# Altium project RK_MEGAPLATA.PrjPcb (part 1 of 9)
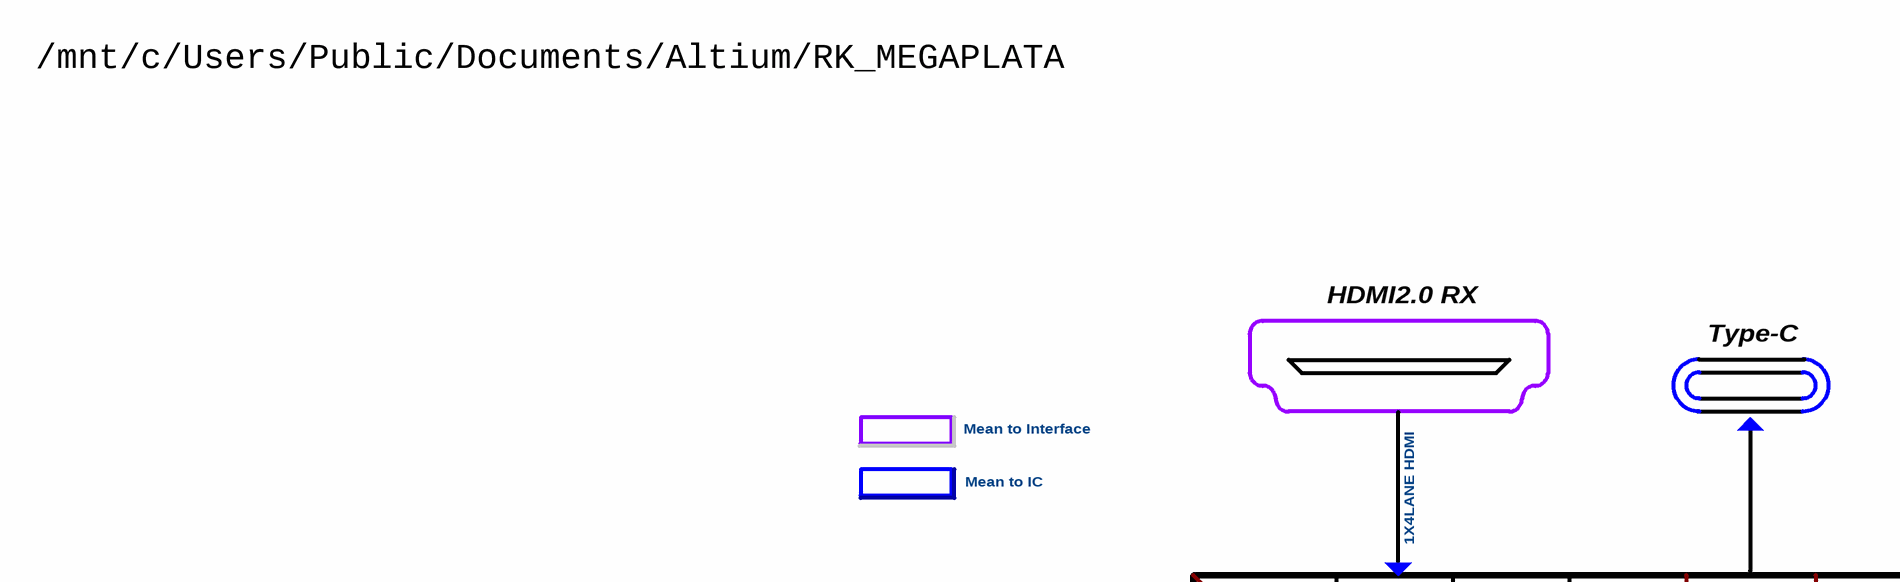
[diagram p0: BLOCK_DIAGRAM.SchDoc, top left]
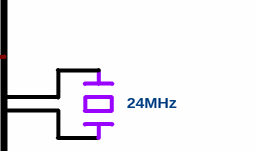
[diagram p1: BLOCK_DIAGRAM.SchDoc, top right]
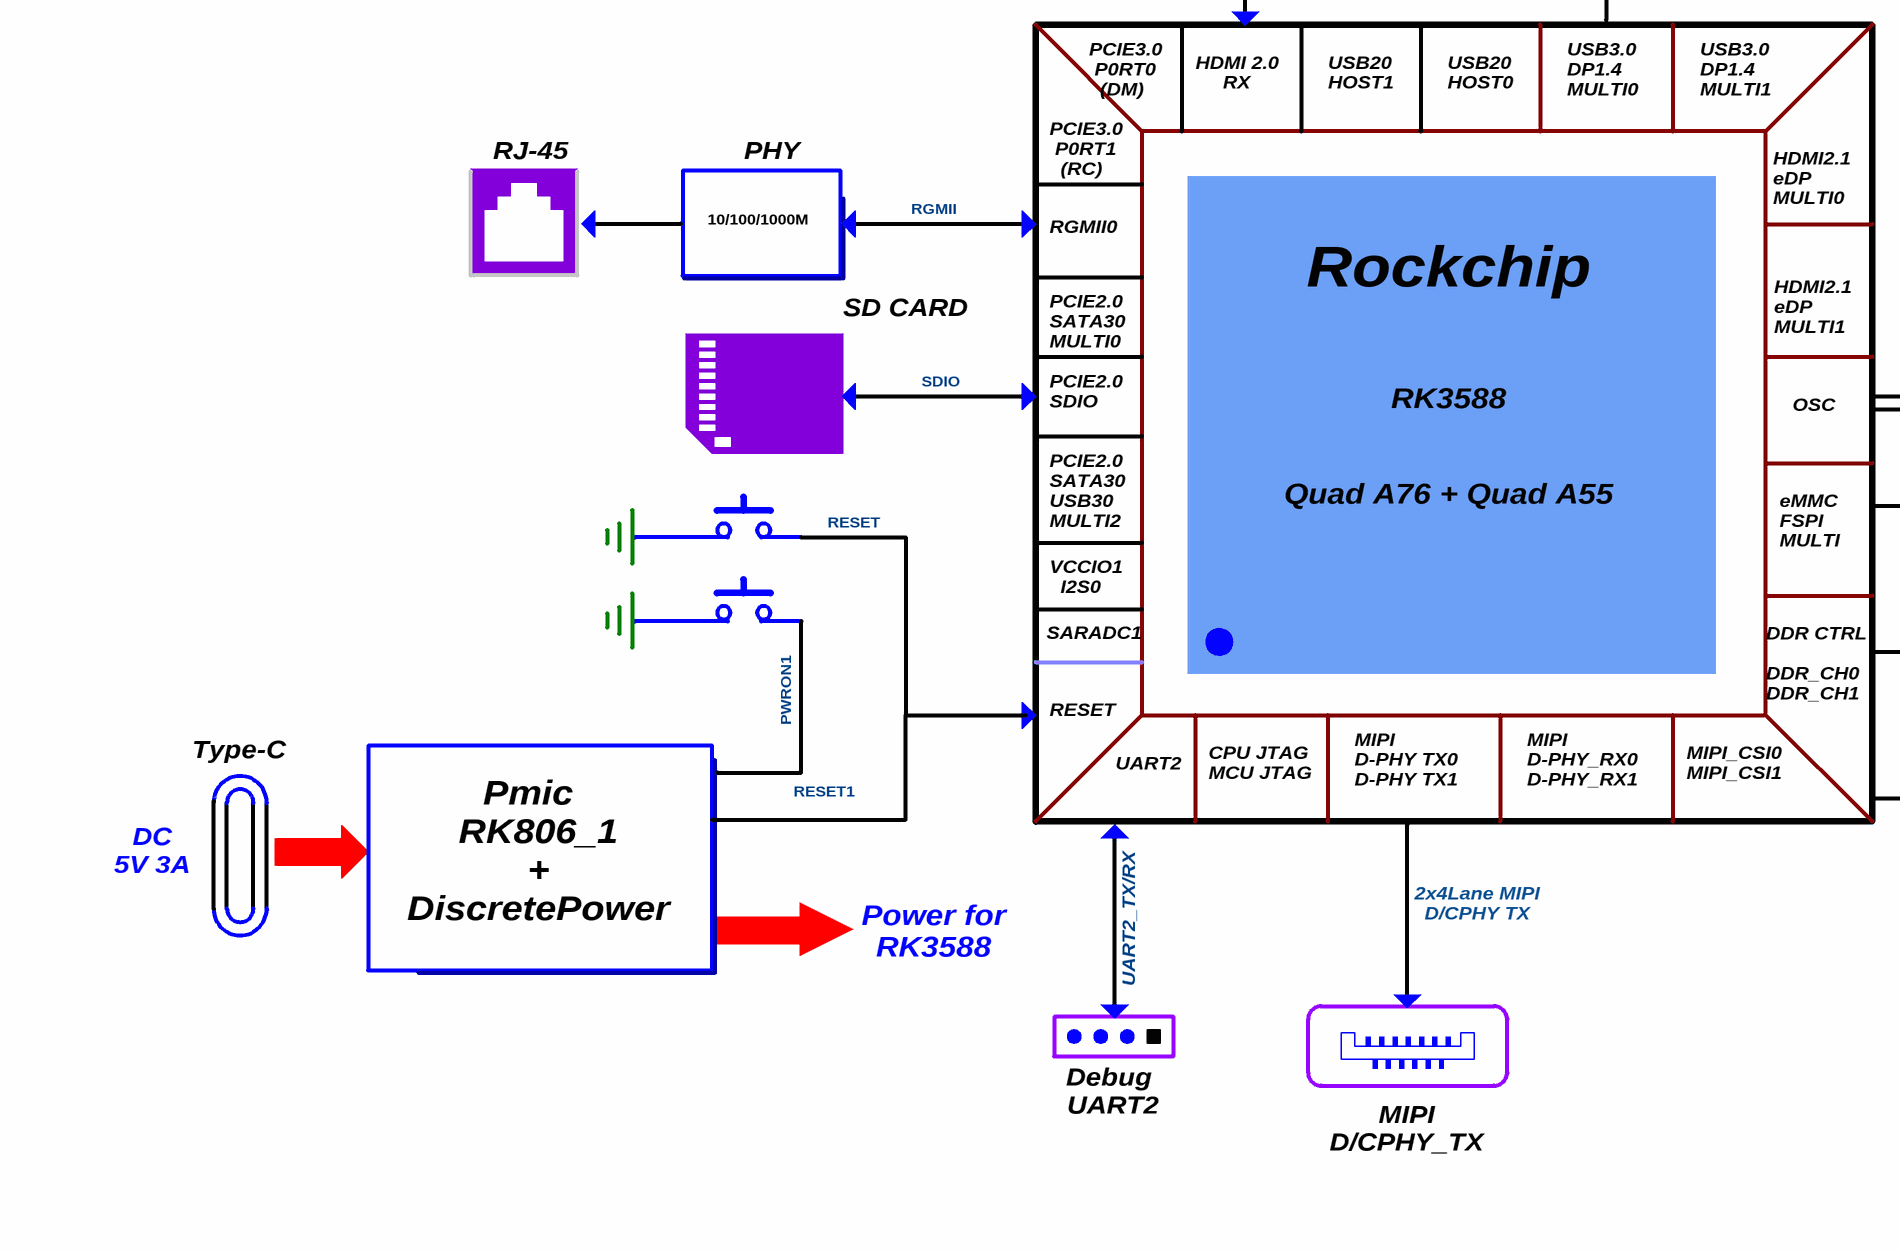
[diagram p2: BLOCK_DIAGRAM.SchDoc, bottom left]
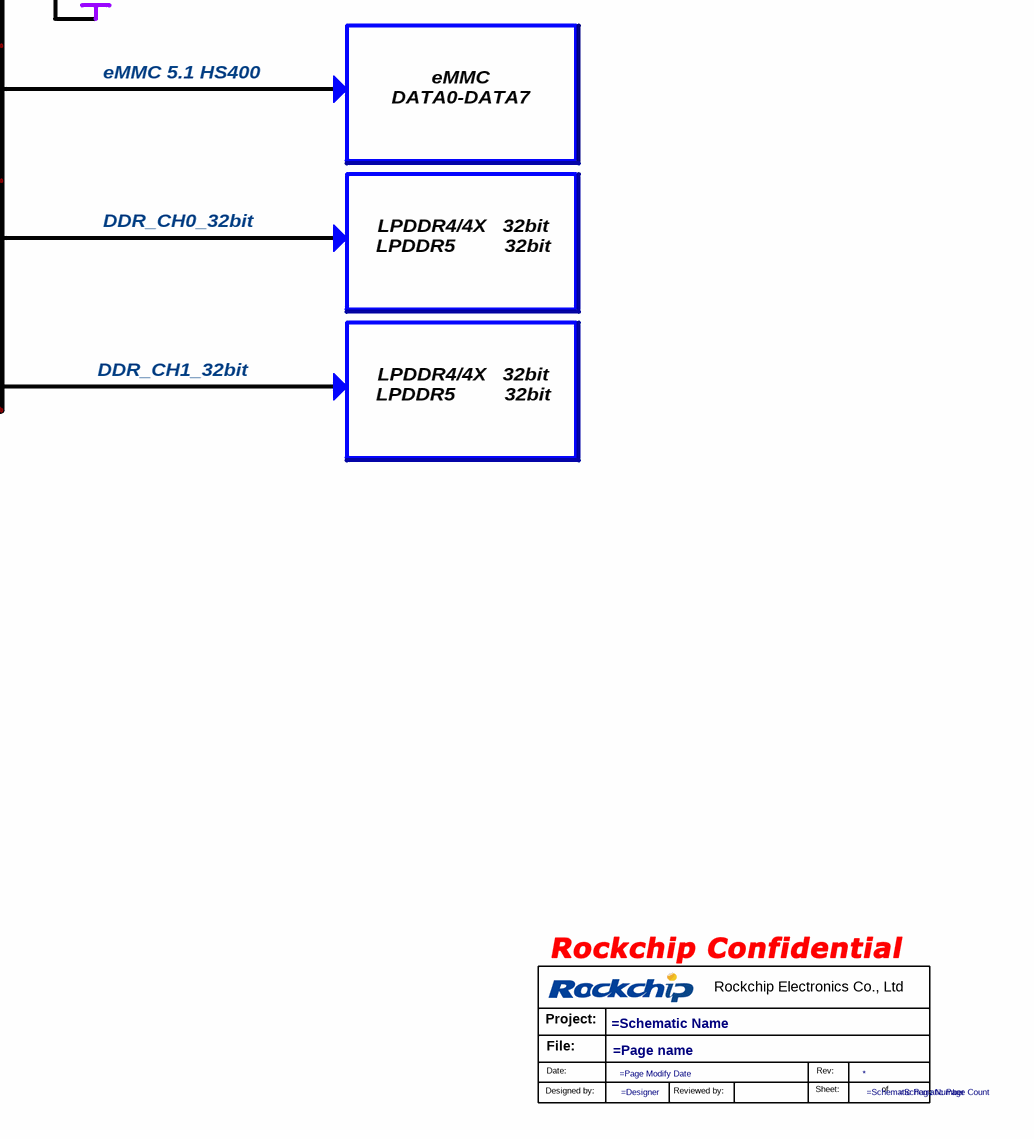
[diagram p3: BLOCK_DIAGRAM.SchDoc, bottom right]
22 sheets, 681 parts. Net scope: flat (ports and power ports of the same name join across sheets).
Sheets:
  BLOCK_DIAGRAM.SchDoc
  RK3588_OSC_PLL.SchDoc
  RK3588_DDR.SchDoc
  RK3588_FLASH_SD_EMMC.SchDoc
  RK3588_TYPE_C.SchDoc
  RK3588_BOOTLOADER_MAYBE_SDIO.SchDoc
  RK3588_MIPI.SchDoc
  RK3588_PCIE20_30.SchDoc
  RK3588_HDMI.SchDoc
  RK3588_GPIO_MAYBE_IMPORTANT_PINS.SchDoc
  UART_DEBUG.SchDoc
  POWER_IN_TYPE_C.SchDoc
  POWER_RK806.SchDoc
  PORT_TYPE_C.SchDoc
  DRAM_LPDDR4X_200P_2X32bit.SchDoc
  FLASH_EMMC.SchDoc
  FLASH_SD_CARD.SchDoc
  SD_CARD_SDIO.SchDoc
  HDMI2_0_RX.SchDoc
  MIPI_D_CPHY_TX_DUAL.SchDoc
  ETHERNET_PHY_RGMII.SchDoc
  BUTTON.SchDoc

## Sheet BLOCK_DIAGRAM.SchDoc
size 594 x 420 mm; SheetNumber: 1; SheetTotal: 25

### Parts
*?  (no value)  (graphical)

### Notes on the sheet
- /mnt/c/Users/Public/Documents/Altium/RK_MEGAPLATA
- HDMI2.0 RX
- Type-C
- Mean to Interface
- Mean to IC
- 1X4LANE HDMI
- HDMI 2.0
  RX
- USB20
  HOST1
- USB20
  HOST0
- USB3.0
  DP1.4
  MULTI0
- USB3.0
  DP1.4
  MULTI1
- RJ-45
- PHY
- PCIE3.0
  P0RT0
  (DM)
- 10/100/1000M
- RGMII
- PCIE3.0
  P0RT1
  (RC)
- HDMI2.1
  eDP
  MULTI0
- RGMII0
- SD CARD
- PCIE2.0
  SATA30
  MULTI0
- Rockchip
- HDMI2.1
  eDP
  MULTI1
- SDIO
- PCIE2.0
  SDIO
- OSC
- 24MHz
- eMMC 5.1 HS400
- RESET
- PCIE2.0
  SATA30
  USB30
  MULTI2
- RK3588
  Quad A76 + Quad A55
- eMMC
  FSPI
  MULTI
- eMMC
  DATA0-DATA7
- VCCIO1
  I2S0
- SARADC1
- DDR_CH0_32bit
- LPDDR4/4X   32bit
  LPDDR5         32bit
- PWRON1
- DDR CTRL
  DDR_CH0
  DDR_CH1
- RESET1
- UART2
- CPU JTAG
  MCU JTAG
- MIPI
  D-PHY TX0
  D-PHY TX1
- MIPI
  D-PHY_RX0
  D-PHY_RX1
- MIPI_CSI0
  MIPI_CSI1
- DDR_CH1_32bit
- DC
  5V 3A
- Pmic
  RK806_1
  +
  DiscretePower
- Power for RK3588
- 2x4Lane MIPI D/CPHY TX
- UART2_TX/RX
- Debug
  UART2
- MIPI
  D/CPHY_TX
- 420x594
- Формат А2
- (in symbol Rockchip_new) Rockchip Electronics Co., Ltd; Project:; File:; Date:; Rev:; Designed by:; Reviewed by:; Sheet:; of

### Library data of the parts
*? = Rockchip_new: Schematic Page Count: =Schematic Page Count; Schematic Page Number: =Schematic Page Number; Designer: =Designer; Page Modify Date: =Page Modify Date; Title: *; Revcode: =Revcode; Page name: =Page name; Schematic Name: =Schematic Name; Revision: *; Check: =Check; Page Count: =Page Count; Page Number: =Page Number; OrgAddr4: =OrgAddr4; OrgAddr3: =OrgAddr3; OrgAddr2: =OrgAddr2; OrgAddr1: =OrgAddr1; OrgName: =OrgName; Cage Code: =Cage Code; Doc: =Doc

## Sheet RK3588_OSC_PLL.SchDoc
size 594 x 420 mm; SheetNumber: 3; SheetTotal: 23
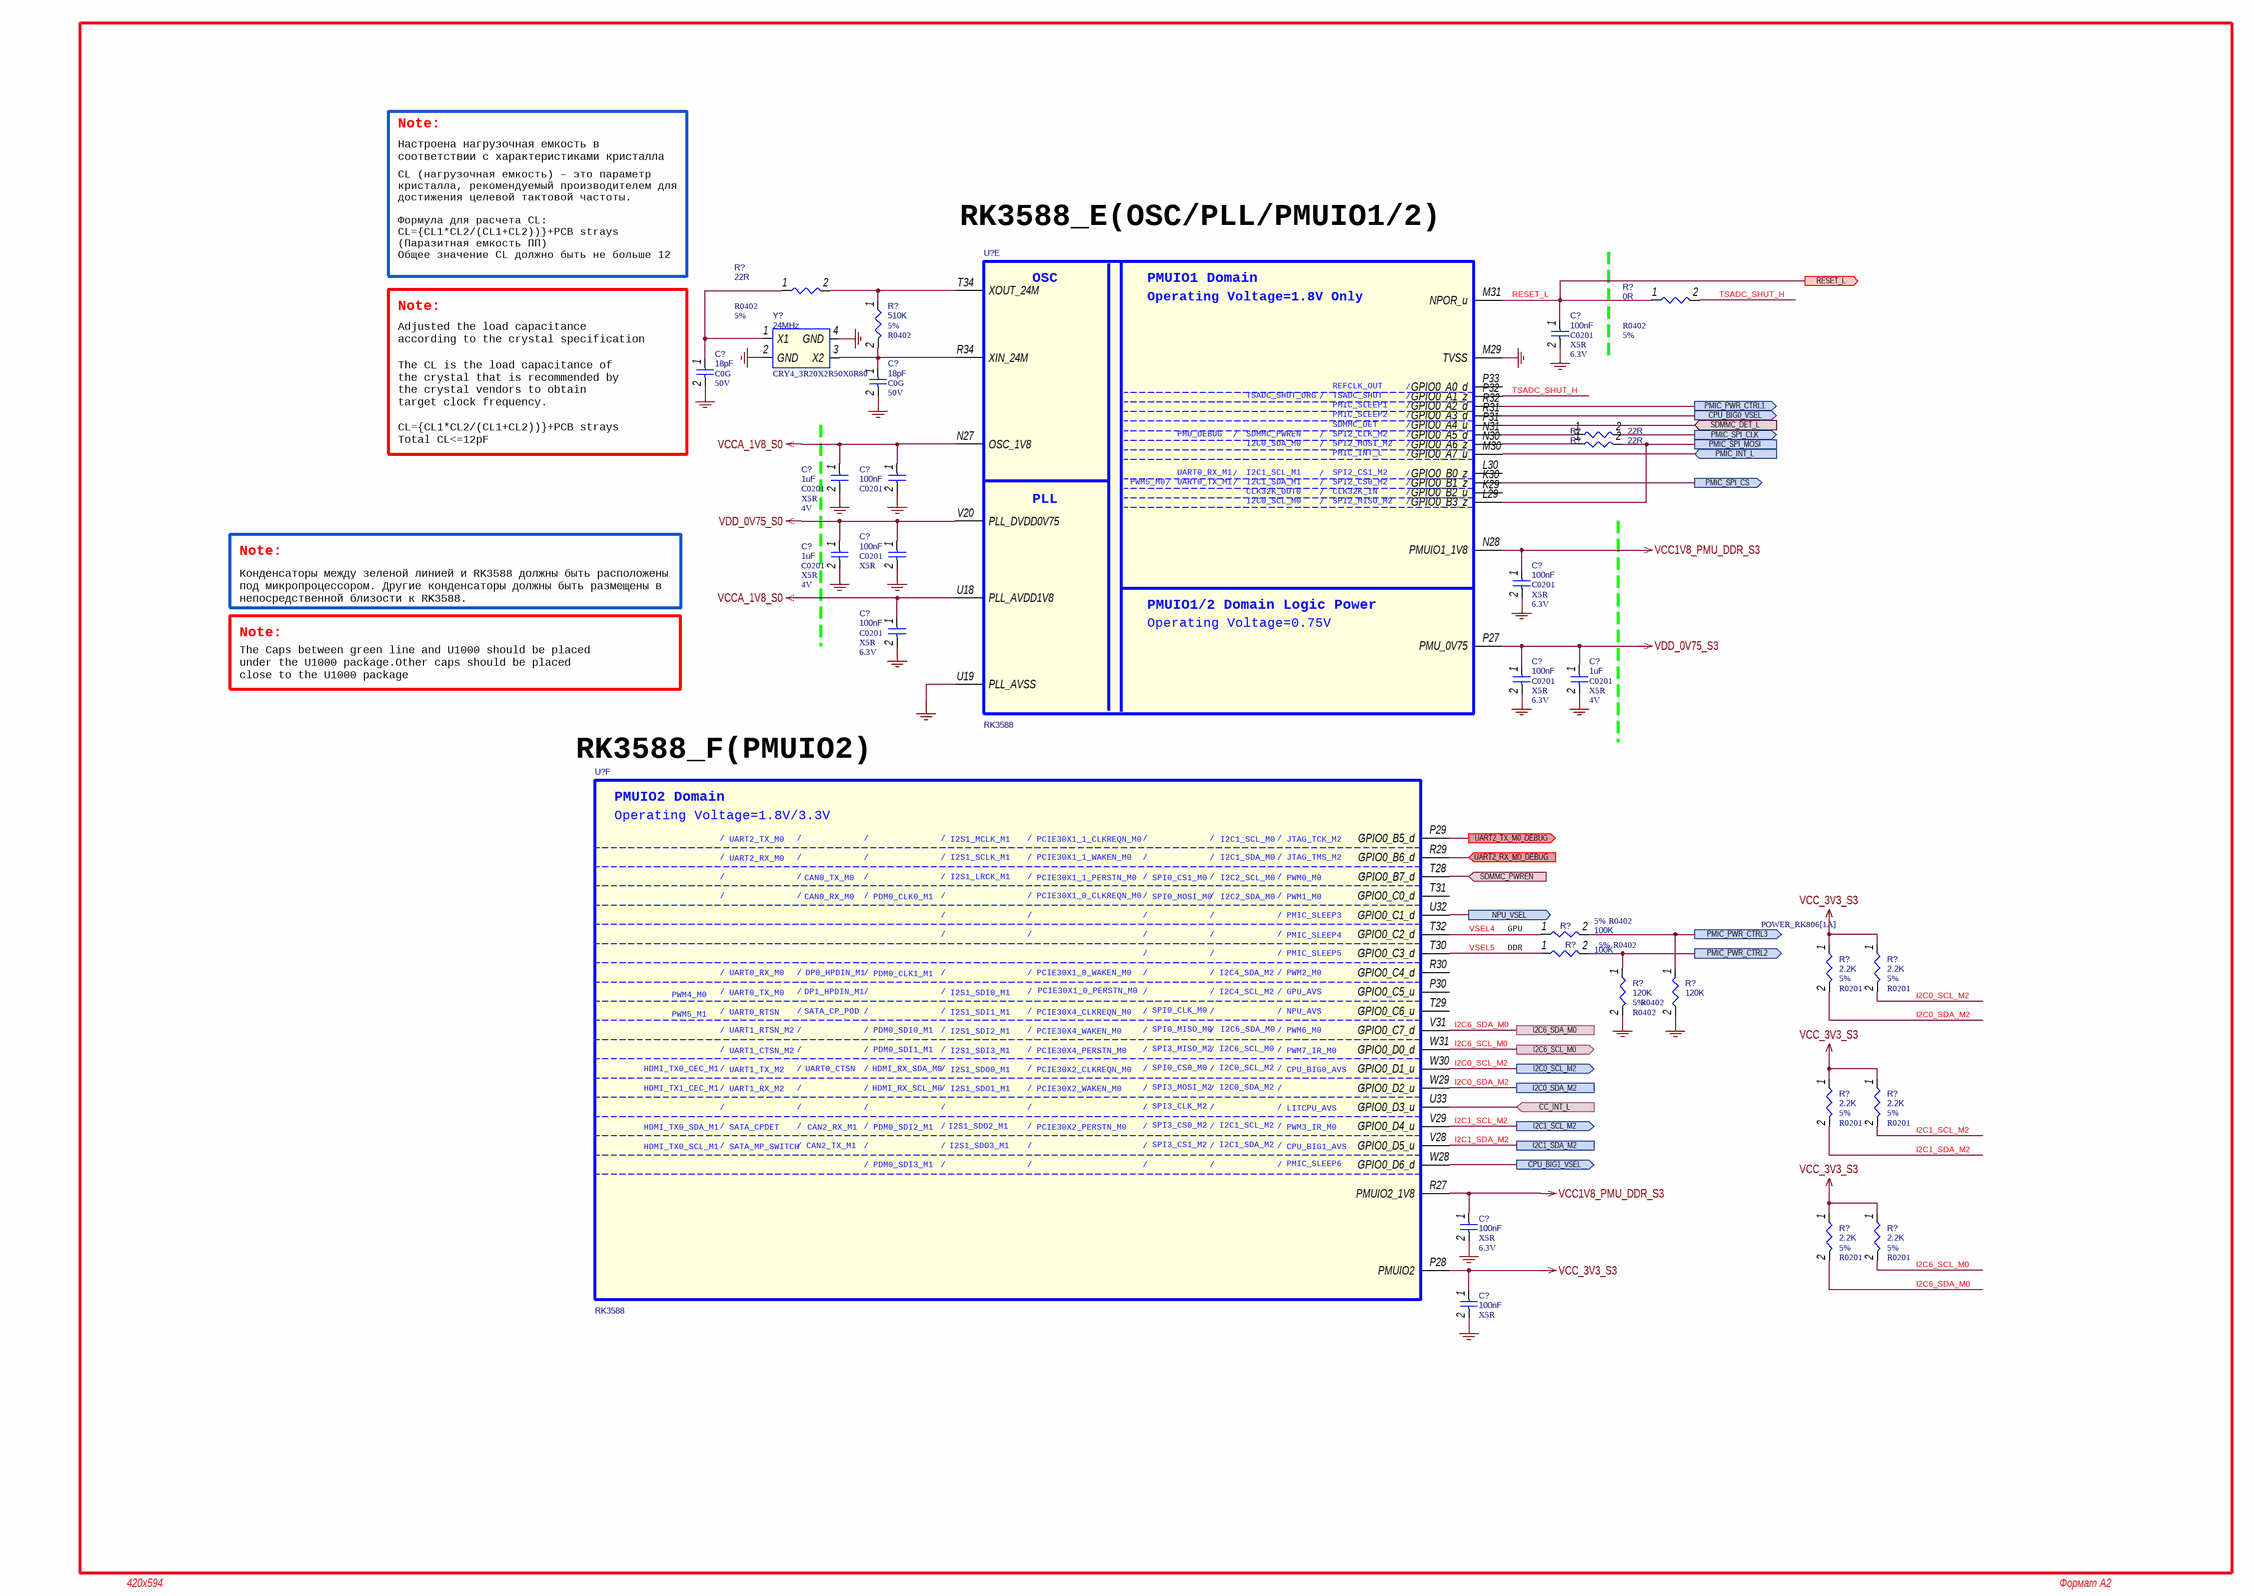
[diagram p4: RK3588_OSC_PLL.SchDoc]

### Parts
(Parts that share a designator on the sheet are numbered #1, #2 ... from top to bottom, then left to right.)
C?#1  100nF  Dielectric: X5R  Voltage: 6.3V  [C0201]
C?#2  18pF  Dielectric: C0G  Voltage: 50V  [C0402]
C?#3  18pF  Dielectric: C0G  Voltage: 50V  [C0402]
C?#4  1uF  Dielectric: X5R  Voltage: 4V  [C0201]
C?#5  100nF  [C0201]
C?#6  1uF  Dielectric: X5R  Voltage: 4V  [C0201]
C?#7  100nF  Dielectric: X5R  [C0201]
C?#8  100nF  Dielectric: X5R  Voltage: 6.3V  [C0201]
C?#9  100nF  Dielectric: X5R  Voltage: 6.3V  [C0201]
C?#10  100nF  Dielectric: X5R  Voltage: 6.3V  [C0201]
C?#11  1uF  Dielectric: X5R  Voltage: 4V  [C0201]
C?#12  100nF  Dielectric: X5R  Voltage: 6.3V  [C0201]
C?#13  100nF  Dielectric: X5R  [C0201]
R?#1  22R  Tolerance: 5%  [R0402]
R?#2  510K  Tolerance: 5%  [R0402]
R?#3  0R  Tolerance: 5%  [R0402]
R?#4  22R  [R0402]
R?#5  22R  [R0402]
R?#6  100K  Tolerance: 5%  [R0402]
R?#7  2.2K  Tolerance: 5%  PCB Footprint: R0201  [R0402]
R?#8  2.2K  Tolerance: 5%  PCB Footprint: R0201  [R0402]
R?#9  100K  Tolerance: 5%  [R0402]
R?#10  120K  Tolerance: 5%  [R0402]
R?#11  120K  [R0402]
R?#12  2.2K  Tolerance: 5%  PCB Footprint: R0201  [R0402]
R?#13  2.2K  Tolerance: 5%  PCB Footprint: R0201  [R0402]
R?#14  2.2K  Tolerance: 5%  PCB Footprint: R0201  [R0402]
R?#15  2.2K  Tolerance: 5%  PCB Footprint: R0201  [R0402]
U?#1  RK3588  [BGA1088_23R00X23R00X2R00]  (part E of 26)
U?#2  RK3588  [BGA1088_23R00X23R00X2R00]  (part F of 26)
Y?#1  24MHz  PCB Footprint: CRY4_3R20X2R50X0R80  [CRY-3225]

### Ports
CC_INT_L (in, see PORT_TYPE_C[2D]), CPU_BIG0_VSEL (out, see POWER_RK806[1A]), CPU_BIG1_VSEL (out, see POWER_RK806[1A]), I2C0_SCL_M2 (out, see POWER_RK806[1A]), I2C0_SDA_M2 (see POWER_RK806[1A]), I2C1_SCL_M2 (out, see POWER_RK806[1A]), I2C1_SDA_M2 (see POWER_RK806[1A]), I2C6_SCL_M0 (out, see PORT_TYPE_C[2D]), I2C6_SDA_M0 (see PORT_TYPE_C[2D]), NPU_VSEL (out, see POWER_RK806[1A]), PMIC_INT_L (in, see POWER_RK806[1A]), PMIC_PWR_CTRL1 (out, see POWER_RK806[1A]), PMIC_PWR_CTRL2 (out, see POWER_RK806[1A]), PMIC_PWR_CTRL3 (out, see POWER_RK806[1A]), PMIC_SPI_CLK (out, see POWER_RK806[1A]), PMIC_SPI_CS (out, see POWER_RK806[1A]), PMIC_SPI_MOSI (see POWER_RK806[1A]), RESET_L (out, see BUTTON[2B], POWER_RK806[1A]), SDMMC_DET_L (in, see FLASH_SD_CARD[2C]), SDMMC_PWREN (in, see FLASH_SD_CARD[2A]), UART2_RX_M0_DEBUG (in, see UART_DEBUG[2B]), UART2_TX_M0_DEBUG (out, see UART_DEBUG[2B])

### Nets
GND: C?#1.2 C?#2.2 C?#3.2 C?#4.2 C?#5.2 C?#6.2 C?#7.2 C?#8.2 C?#9.2 C?#10.2 C?#11.2 C?#12.2 C?#13.2 R?#10.2 R?#11.2 U?#1.M29(TVSS) U?#1.U19(PLL_AVSS) Y?#1.2(GND) Y?#1.4(GND)
VCC1V8_PMU_DDR_S3: C?#8.1 C?#12.1 U?#1.N28(PMUIO1_1V8) U?#2.R27(PMUIO2_1V8)
VCC_3V3_S3: C?#13.1 R?#7.1 R?#8.1 R?#12.1 R?#13.1 R?#14.1 R?#15.1 U?#2.P28(PMUIO2)
VCCA_1V8_S0: C?#4.1 C?#5.1 C?#9.1 U?#1.N27(OSC_1V8) U?#1.U18(PLL_AVDD1V8)
VDD_0V75_S0: C?#6.1 C?#7.1 U?#1.V20(PLL_DVDD0V75)
VDD_0V75_S3: C?#10.1 C?#11.1 U?#1.P27(PMU_0V75)
CC_INT_L: U?#2.U33(GPIO0_D3_u) ; port CC_INT_L
CPU_BIG0_VSEL: U?#1.R31(GPIO0_A3_d) ; port CPU_BIG0_VSEL
CPU_BIG1_VSEL: U?#2.W28(GPIO0_D6_d) ; port CPU_BIG1_VSEL
I2C0_SCL_M2: R?#8.2 U?#2.W30(GPIO0_D1_u) ; port I2C0_SCL_M2
I2C0_SDA_M2: R?#7.2 U?#2.W29(GPIO0_D2_u) ; port I2C0_SDA_M2
I2C1_SCL_M2: R?#13.2 U?#2.V29(GPIO0_D4_u) ; port I2C1_SCL_M2
I2C1_SDA_M2: R?#12.2 U?#2.V28(GPIO0_D5_u) ; port I2C1_SDA_M2
I2C6_SCL_M0: R?#15.2 U?#2.W31(GPIO0_D0_d) ; port I2C6_SCL_M0
I2C6_SDA_M0: R?#14.2 U?#2.V31(GPIO0_C7_d) ; port I2C6_SDA_M0
NPU_VSEL: U?#2.U32(GPIO0_C1_d) ; port NPU_VSEL
PMIC_INT_L: U?#1.M30(GPIO0_A7_u) ; port PMIC_INT_L
PMIC_PWR_CTRL1: U?#1.R32(GPIO0_A2_d) ; port PMIC_PWR_CTRL1
PMIC_PWR_CTRL2: R?#9.2 R?#10.1 ; port PMIC_PWR_CTRL2
PMIC_PWR_CTRL3: R?#6.2 R?#11.1 ; port PMIC_PWR_CTRL3
PMIC_SPI_CLK: R?#4.2 ; port PMIC_SPI_CLK
PMIC_SPI_CS: U?#1.K30(GPIO0_B1_z) ; port PMIC_SPI_CS
PMIC_SPI_MOSI: R?#5.2 U?#1.L29(GPIO0_B3_z) ; port PMIC_SPI_MOSI
RESET_L: C?#1.1 R?#3.1 U?#1.M31(NPOR_u) ; port RESET_L
SDMMC_DET_L: U?#1.P31(GPIO0_A4_u) ; port SDMMC_DET_L
SDMMC_PWREN: U?#2.T28(GPIO0_B7_d) ; port SDMMC_PWREN
TSADC_SHUT_H: R?#3.2 U?#1.P32(GPIO0_A1_z)
VSEL4: R?#6.1 U?#2.T32(GPIO0_C2_d)
VSEL5: R?#9.1 U?#2.T30(GPIO0_C3_d)
NetC?#2_1: C?#2.1 R?#1.1 Y?#1.1(X1)
NetC?#3_1: C?#3.1 R?#2.2 U?#1.R34(XIN_24M) Y?#1.3(X2)
NetR?#1_2: R?#1.2 R?#2.1 U?#1.T34(XOUT_24M)
NetR?#4_1: R?#4.1 U?#1.N31(GPIO0_A5_d)
NetR?#5_1: R?#5.1 U?#1.N30(GPIO0_A6_z)
NetR?#37_1: U?#2.R29(GPIO0_B6_d) ; port UART2_RX_M0_DEBUG
NetR?#38_1: U?#2.P29(GPIO0_B5_d) ; port UART2_TX_M0_DEBUG

Not connected (* = marked no-connect by the designer): U?#1 K29(GPIO0_B2_u) L30(GPIO0_B0_z) P33(GPIO0_A0_d); U?#2 P30(GPIO0_C5_u) R30(GPIO0_C4_d) T29(GPIO0_C6_u) T31(GPIO0_C0_d)

### Notes on the sheet
- Настроена нагрузочная емкость в соответствии с характеристиками кристалла
- Note:
- CL (нагрузочная емкость) – это параметр кристалла, рекомендуемый производителем для достижения целевой тактовой частоты.
  Формула для расчета CL:
  CL={CL1*CL2/(CL1+CL2))}+PCB strays      (Паразитная емкость ПП)
  Общее значение CL должно быть не больше 12 пФ.
- RK3588_E(OSC/PLL/PMUIO1/2)
- (near C?#2) Adjusted the load capacitance
  according to the crystal specification
- (near C?#2) The CL is the load capacitance of
  the crystal that is recommended by
  the crystal vendors to obtain
  target clock frequency.
  CL={CL1*CL2/(CL1+CL2))}+PCB strays
  Total CL<=12pF
- Конденсаторы между зеленой линией и RK3588 должны быть расположены под микропроцессором. Другие конденсаторы должны быть размещены в непосредственной близости к RK3588.
- The Caps between green line and U1000 should be placed
  under the U1000 package.Other caps should be placed
  close to the U1000 package
- RK3588_F(PMUIO2)
- (near R?#6) GPU
- (near R?#9) DDR
- 420x594
- Формат А2
- (in symbol SOC_RK3588, part E) OSC; PMUIO1 Domain; Operating Voltage=1.8V Only; REFCLK_OUT; /; TSADC_SHUT_ORG; TSADC_SHUT; PMIC_SLEEP1; PMIC_SLEEP2; SDMMC_DET; PMU_DEBUG; SDMMC_PWREN; SPI2_CLK_M2; I2C0_SDA_M0; SPI2_MOSI_M2; PMIC_INT_L; UART0_RX_M1; I2C1_SCL_M1; SPI2_CS1_M2; PWM5_M0; UART0_TX_M1; I2C1_SDA_M1; SPI2_CS0_M2; CLK32K_OUT0; CLK32K_IN; PLL; I2C0_SCL_M0; SPI2_MISO_M2; PMUIO1/2 Domain Logic Power; Operating Voltage=0.75V
- (in symbol SOC_RK3588, part F) PMUIO2 Domain; Operating Voltage=1.8V/3.3V; /; UART2_TX_M0; I2S1_MCLK_M1; PCIE30X1_1_CLKREQN_M0; I2C1_SCL_M0; JTAG_TCK_M2; UART2_RX_M0; I2S1_SCLK_M1; PCIE30X1_1_WAKEN_M0; I2C1_SDA_M0; JTAG_TMS_M2; CAN0_TX_M0; I2S1_LRCK_M1; PCIE30X1_1_PERSTN_M0; SPI0_CS1_M0; I2C2_SCL_M0; PWM0_M0; CAN0_RX_M0; PDM0_CLK0_M1; PCIE30X1_0_CLKREQN_M0; SPI0_MOSI_M0; I2C2_SDA_M0; PWM1_M0; PMIC_SLEEP3; PMIC_SLEEP4; PMIC_SLEEP5; UART0_RX_M0; DP0_HPDIN_M1; PDM0_CLK1_M1; PCIE30X1_0_WAKEN_M0; I2C4_SDA_M2; PWM2_M0; UART0_TX_M0; DP1_HPDIN_M1; I2S1_SDI0_M1; PCIE30X1_0_PERSTN_M0; I2C4_SCL_M2; GPU_AVS; PWM4_M0; UART0_RTSN; SATA_CP_POD; I2S1_SDI1_M1; PCIE30X4_CLKREQN_M0; SPI0_CLK_M0; NPU_AVS; PWM5_M1; UART1_RTSN_M2; PDM0_SDI0_M1; I2S1_SDI2_M1; PCIE30X4_WAKEN_M0; SPI0_MISO_M0; I2C6_SDA_M0; PWM6_M0; UART1_CTSN_M2; PDM0_SDI1_M1; I2S1_SDI3_M1; PCIE30X4_PERSTN_M0; SPI3_MISO_M2; I2C6_SCL_M0; PWM7_IR_M0; HDMI_TX0_CEC_M1; UART1_TX_M2; UART0_CTSN; HDMI_RX_SDA_M0; I2S1_SDO0_M1; PCIE30X2_CLKREQN_M0; SPI0_CS0_M0; I2C0_SCL_M2; CPU_BIG0_AVS; HDMI_TX1_CEC_M1; UART1_RX_M2; HDMI_RX_SCL_M0; I2S1_SDO1_M1; PCIE30X2_WAKEN_M0; SPI3_MOSI_M2; I2C0_SDA_M2; SPI3_CLK_M2; LITCPU_AVS; HDMI_TX0_SDA_M1; SATA_CPDET; CAN2_RX_M1; PDM0_SDI2_M1; I2S1_SDO2_M1; PCIE30X2_PERSTN_M0; SPI3_CS0_M2; I2C1_SCL_M2; PWM3_IR_M0; HDMI_TX0_SCL_M1; SATA_MP_SWITCH; CAN2_TX_M1; I2S1_SDO3_M1; SPI3_CS1_M2; I2C1_SDA_M2; CPU_BIG1_AVS; PDM0_SDI3_M1; PMIC_SLEEP6

### Library data of the parts
C?#1 = CAP NP_Dup1: cap,100.00nF,+/-10%,6.3V,X5R,C0201; Part Reference: C1100; Manufacturer: TDK; RK PN: C0603X5R0J104K030BC; Priority: A; Tolerance: 10%; PCB Footprint: C0201; Value: 100nF; Part Type: C0201; Manufacturer PN: C0603X5R0J104K030BC; Created by: JJJ
C?#2 = CAP NP_Dup1: cap,18.00pF,+/-5%,50V,C0G,C0402; Part Reference: C1101; Manufacturer: TDK; Number: 37; RK PN: C1005C0G1H180J050BA; Priority: A; Tolerance: 5%; C_Voltage: 6.3V; Value: 18pF; Part Type: C0402; Manufacturer PN: C1005C0G1H180J050BA; Created by: JJJ
C?#3 = CAP NP_Dup1: cap,18.00pF,+/-5%,50V,C0G,C0402; Part Reference: C1102; Manufacturer PN: C1005C0G1H180J050BA; Manufacturer: TDK; C_Voltage: 6.3V; Tolerance: 5%; Priority: A; Number: 37; Value: 18pF; Created by: JJJ; Part Type: C0402; RK PN: C1005C0G1H180J050BA
C?#4 = CAP NP_Dup1: cap,1.00uF,+/-20%,4V,X5R,C0201; Part Reference: C1103; Manufacturer: TDK; RK PN: C0603X5R0G105M030BC; Priority: A; Tolerance: 20%; PCB Footprint: C0201; Value: 1uF; Part Type: C0201; Manufacturer PN: C0603X5R0G105M030BC; Created by: JJJ
C?#5 = CAP NP_Dup1: cap,100.00nF,+/-10%,6.3V,X5R,C0201; Part Reference: C1104; Manufacturer PN: C0603X5R0J104K030BC; Manufacturer: TDK; Tolerance: 10%; Priority: A; PCB Footprint: C0201; Value: 100nF; Created by: JJJ; Part Type: C0201; RK PN: C0603X5R0J104K030BC
C?#6 = CAP NP_Dup1: cap,1.00uF,+/-20%,4V,X5R,C0201; Part Reference: C1105; Manufacturer PN: C0603X5R0G105M030BC; Manufacturer: TDK; Tolerance: 20%; Priority: A; PCB Footprint: C0201; Value: 1uF; Created by: JJJ; Part Type: C0201; RK PN: C0603X5R0G105M030BC
C?#7 = CAP NP_Dup1: cap,100.00nF,+/-10%,6.3V,X5R,C0201; Part Reference: C1106; Manufacturer: TDK; RK PN: C0603X5R0J104K030BC; Priority: A; Tolerance: 10%; PCB Footprint: C0201; Value: 100nF; Part Type: C0201; Manufacturer PN: C0603X5R0J104K030BC; Created by: JJJ
C?#8 = CAP NP_Dup1: cap,100.00nF,+/-10%,6.3V,X5R,C0201; Part Reference: C1107; Manufacturer: TDK; RK PN: C0603X5R0J104K030BC; Priority: A; Tolerance: 10%; PCB Footprint: C0201; Value: 100nF; Part Type: C0201; Manufacturer PN: C0603X5R0J104K030BC; Created by: JJJ
C?#9 = CAP NP_Dup1: cap,100.00nF,+/-10%,6.3V,X5R,C0201; Part Reference: C1109; Manufacturer: TDK; RK PN: C0603X5R0J104K030BC; Priority: A; Tolerance: 10%; PCB Footprint: C0201; Value: 100nF; Part Type: C0201; Manufacturer PN: C0603X5R0J104K030BC; Created by: JJJ
C?#10 = CAP NP_Dup1: cap,100.00nF,+/-10%,6.3V,X5R,C0201; Part Reference: C1110; Manufacturer: TDK; RK PN: C0603X5R0J104K030BC; Priority: A; Tolerance: 10%; PCB Footprint: C0201; Value: 100nF; Part Type: C0201; Manufacturer PN: C0603X5R0J104K030BC; Created by: JJJ
C?#11 = CAP NP_Dup1: cap,1.00uF,+/-20%,4V,X5R,C0201; Part Reference: C1111; Manufacturer PN: C0603X5R0G105M030BC; Manufacturer: TDK; Tolerance: 20%; Priority: A; PCB Footprint: C0201; Value: 1uF; Created by: JJJ; Part Type: C0201; RK PN: C0603X5R0G105M030BC
C?#12 = CAP NP_Dup1: cap,100.00nF,+/-10%,6.3V,X5R,C0201; Part Reference: C1112; Manufacturer: TDK; RK PN: C0603X5R0J104K030BC; Priority: A; Tolerance: 10%; Value: 100nF; Part Type: C0201; Manufacturer PN: C0603X5R0J104K030BC; Created by: JJJ
C?#13 = CAP NP_Dup1: cap,100.00nF,+/-10%,6.3V,X5R,C0201; Part Reference: C1113; Manufacturer PN: C0603X5R0J104K030BC; Manufacturer: TDK; Tolerance: 10%; Priority: A; Value: 100nF; Created by: JJJ; Part Type: C0201; RK PN: C0603X5R0J104K030BC
R?#1 = RESISTOR_Dup2: НЁУГєсД¤µзЧи,22R,+/-5%,R0402,1/16W.; Part Reference: R1101; Manufacturer PN: RC0402JR-0722RL; Manufacturer: YAGEO; Wattage: 1/16W; Priority: A; PCB Footprint: R0402; Value: 22R; Created by: YTL; Part Type: НЁУГєсД¤µзЧи; RK PN: RC0402JR-0722RL
R?#2 = RESISTOR_Dup2: НЁУГєсД¤µзЧи,510K,+/-5%,R0402,1/16W.; Part Reference: R1103; Manufacturer PN: RC0402JR-07510KL; Manufacturer: YAGEO; Wattage: 1/16W; Priority: A; PCB Footprint: R0402; Value: 510K; Created by: YTL; Part Type: НЁУГєсД¤µзЧи; RK PN: RC0402JR-07510KL
R?#3 = RESISTOR_Dup2: НЁУГєсД¤µзЧи,0R,+/-5%,R0402,1/16W.; Part Reference: R1100; Manufacturer PN: RC0402JR-070RL; Manufacturer: YAGEO; Wattage: 1/16W; Priority: A; PCB Footprint: R0402; Value: 0R; Created by: YTL; Part Type: НЁУГєсД¤µзЧи; RK PN: RC0402JR-070RL
R?#4 = RESISTOR_Dup2: НЁУГєсД¤µзЧи,22R,+/-5%,R0402,1/16W.; Part Reference: R1104; Manufacturer PN: RC0402JR-0722RL; Manufacturer: YAGEO; Wattage: 1/16W; Priority: A; Value: 22R; Created by: YTL; Part Type: НЁУГєсД¤µзЧи; RK PN: RC0402JR-0722RL
R?#5 = RESISTOR_Dup2: НЁУГєсД¤µзЧи,22R,+/-5%,R0402,1/16W.; Part Reference: R1107; Manufacturer: YAGEO; RK PN: RC0402JR-0722RL; Priority: A; Wattage: 1/16W; Value: 22R; Part Type: НЁУГєсД¤µзЧи; Manufacturer PN: RC0402JR-0722RL; Created by: YTL
R?#6 = RESISTOR_Dup2: НЁУГєсД¤µзЧи,100K,+/-5%,R0402,1/16W.; Part Reference: R1109; Manufacturer: YAGEO; RK PN: RC0402JR-07100KL; Priority: A; Wattage: 1/16W; PCB Footprint: R0402; Value: 100K; Part Type: НЁУГєсД¤µзЧи; Manufacturer PN: RC0402JR-07100KL; Created by: YTL
R?#7 = RESISTOR_Dup2: НЁУГєсД¤µзЧи,2K2,+/-5%,R0201,1/20W.; Part Reference: R1139; Manufacturer PN: RC0201JR-072K2L; Manufacturer: YAGEO; Wattage: 1/20W; Priority: A; Value: 2.2K; Created by: YTL; Part Type: НЁУГєсД¤µзЧи; RK PN: RC0201JR-072K2L
R?#8 = RESISTOR_Dup2: НЁУГєсД¤µзЧи,2K2,+/-5%,R0201,1/20W.; Part Reference: R1140; Manufacturer PN: RC0201JR-072K2L; Manufacturer: YAGEO; Wattage: 1/20W; Priority: A; Value: 2.2K; Created by: YTL; Part Type: НЁУГєсД¤µзЧи; RK PN: RC0201JR-072K2L
R?#9 = RESISTOR_Dup2: НЁУГєсД¤µзЧи,100K,+/-5%,R0402,1/16W.; Part Reference: R1115; Manufacturer PN: RC0402JR-07100KL; Manufacturer: YAGEO; Wattage: 1/16W; Priority: A; PCB Footprint: R0402; Value: 100K; Created by: YTL; Part Type: НЁУГєсД¤µзЧи; RK PN: RC0402JR-07100KL
R?#10 = RESISTOR_Dup2: НЁУГєсД¤µзЧи,120K,+/-5%,R0402,1/16W.; Part Reference: R1116; Manufacturer PN: RC0402JR-07120KL; Manufacturer: YAGEO; Wattage: 1/16W; Priority: A; PCB Footprint: R0402; Value: 120K; Created by: YTL; Part Type: НЁУГєсД¤µзЧи; RK PN: RC0402JR-07120KL
R?#11 = RESISTOR_Dup2: НЁУГєсД¤µзЧи,120K,+/-5%,R0402,1/16W.; Part Reference: R1110; Manufacturer PN: RC0402JR-07120KL; Manufacturer: YAGEO; Tolerance: 5%; Priority: A; Wattage: 1/16W; PCB Footprint: R0402; Value: 120K; Created by: YTL; Part Type: НЁУГєсД¤µзЧи; RK PN: RC0402JR-07120KL
R?#12 = RESISTOR_Dup2: НЁУГєсД¤µзЧи,2K2,+/-5%,R0201,1/20W.; Part Reference: R1113; Manufacturer PN: RC0201JR-072K2L; Manufacturer: YAGEO; Wattage: 1/20W; Priority: A; Value: 2.2K; Created by: YTL; Part Type: НЁУГєсД¤µзЧи; RK PN: RC0201JR-072K2L
R?#13 = RESISTOR_Dup2: НЁУГєсД¤µзЧи,2K2,+/-5%,R0201,1/20W.; Part Reference: R1114; Manufacturer PN: RC0201JR-072K2L; Manufacturer: YAGEO; Wattage: 1/20W; Priority: A; Value: 2.2K; Created by: YTL; Part Type: НЁУГєсД¤µзЧи; RK PN: RC0201JR-072K2L
R?#14 = RESISTOR_Dup2: НЁУГєсД¤µзЧи,2K2,+/-5%,R0201,1/20W.; Part Reference: R1130; Manufacturer: YAGEO; RK PN: RC0201JR-072K2L; Priority: A; Wattage: 1/20W; Value: 2.2K; Part Type: НЁУГєсД¤µзЧи; Manufacturer PN: RC0201JR-072K2L; Created by: YTL
R?#15 = RESISTOR_Dup2: НЁУГєсД¤µзЧи,2K2,+/-5%,R0201,1/20W.; Part Reference: R1131; Manufacturer: YAGEO; RK PN: RC0201JR-072K2L; Priority: A; Wattage: 1/20W; Value: 2.2K; Part Type: НЁУГєсД¤µзЧи; Manufacturer PN: RC0201JR-072K2L; Created by: YTL
U?#1 U?#2 = SOC_RK3588: ROCKCHIP SOC; Part Reference: U1000; Manufacturer: Rockchip (ИрРѕОў); SWAP_INFO: (S1+S2+S3+S4+S5+S6+S7+S8+S9+S10+S11+S12+S13+S14+S15+S16+S17+S18+S19+S20+S21+S22+S23+S24+S25+S26); SPLIT_INST: TRUE; Priority: A; Value: RK3588; PCB Footprint: BGA1088_23R00X23R00X2R00; RK PN: RK3588; Part Type: SOC; Manufacturer PN: RK3588; Created by: YWQ
Y?#1 = CRYSTAL_4P: ОЮФґѕ§ХсЈ¬24MЈ¬3225,ЎА10ppmЈ¬8pFЈ¬Hosonic; Part Reference: Y1100; Manufacturer PN: E3SB24.0000F08E11; Manufacturer: Hosonic(єиРЗµзЧУ); Priority: A; Value: 24MHz; Created by: JJJ; Part Type: CRYSTAL; RK PN: E3SB24.0000F08E11

## Sheet RK3588_DDR.SchDoc
size 594 x 420 mm; SheetNumber: 4; SheetTotal: 24
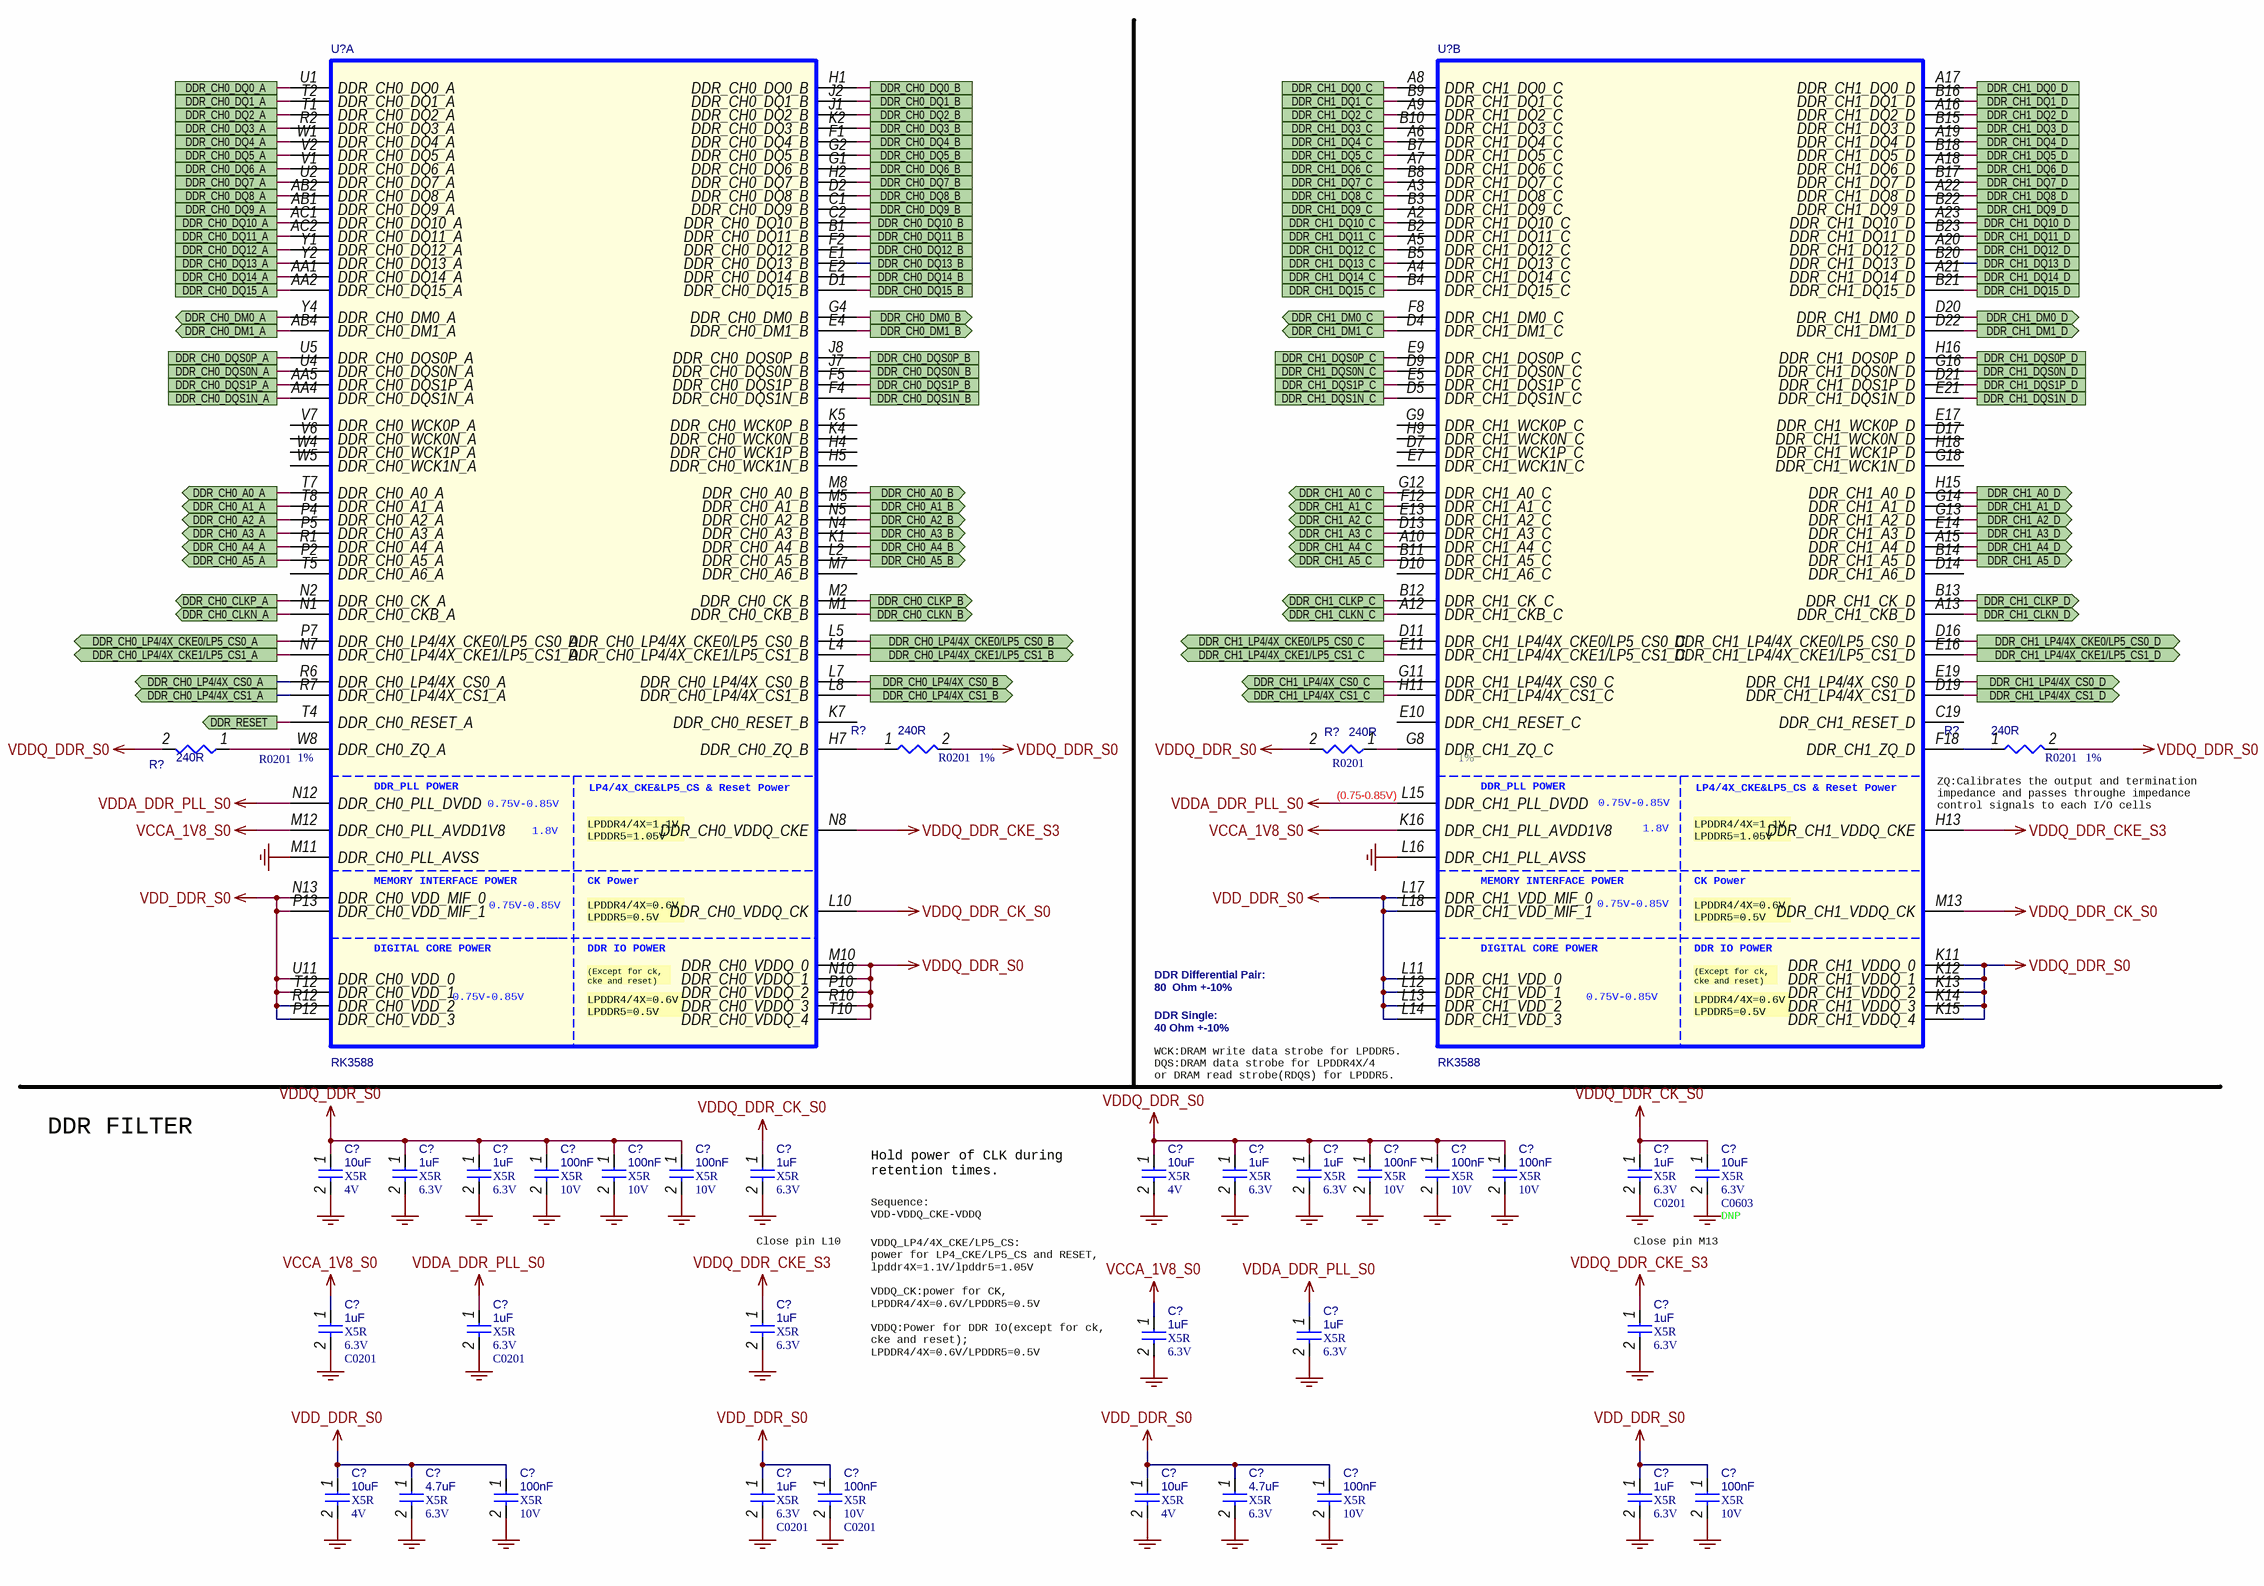
[diagram p5: RK3588_DDR.SchDoc]

### Parts
(Parts that share a designator on the sheet are numbered #1, #2 ... from top to bottom, then left to right.)
C?#14  10uF  Dielectric: X5R  Voltage: 4V  [C0402_BGA]
C?#15  1uF  Dielectric: X5R  Voltage: 6.3V  [C0201]
C?#16  1uF  Dielectric: X5R  Voltage: 6.3V  [C0201]
C?#17  100nF  Dielectric: X5R  Voltage: 10V  [C0201]
C?#18  100nF  Dielectric: X5R  Voltage: 10V  [C0201]
C?#19  100nF  Dielectric: X5R  Voltage: 10V  [C0201]
C?#20  1uF  Dielectric: X5R  Voltage: 6.3V  [C0201]
C?#21  10uF  Dielectric: X5R  Voltage: 4V  [C0402_BGA]
C?#22  1uF  Dielectric: X5R  Voltage: 6.3V  [C0201]
C?#23  1uF  Dielectric: X5R  Voltage: 6.3V  [C0201]
C?#24  100nF  Dielectric: X5R  Voltage: 10V  [C0201]
C?#25  100nF  Dielectric: X5R  Voltage: 10V  [C0201]
C?#26  100nF  Dielectric: X5R  Voltage: 10V  [C0201]
C?#27  1uF  Dielectric: X5R  Voltage: 6.3V  [C0201]
C?#28  10uF  Dielectric: X5R  Voltage: 6.3V  Option: DNP  [C0603]
C?#29  1uF  Dielectric: X5R  Voltage: 6.3V  [C0201]
C?#30  1uF  Dielectric: X5R  Voltage: 6.3V  [C0201]
C?#31  1uF  Dielectric: X5R  Voltage: 6.3V  [C0201]
C?#32  1uF  Dielectric: X5R  Voltage: 6.3V  [C0201]
C?#33  1uF  Dielectric: X5R  Voltage: 6.3V  [C0201]
C?#34  1uF  Dielectric: X5R  Voltage: 6.3V  [C0201]
C?#35  10uF  Dielectric: X5R  Voltage: 4V  [C0402_BGA]
C?#36  4.7uF  Dielectric: X5R  Voltage: 6.3V  [C0402_BGA]
C?#37  100nF  Dielectric: X5R  Voltage: 10V  [C0201]
C?#38  1uF  Dielectric: X5R  Voltage: 6.3V  [C0201]
C?#39  100nF  Dielectric: X5R  Voltage: 10V  [C0201]
C?#40  10uF  Dielectric: X5R  Voltage: 4V  [C0402_BGA]
C?#41  4.7uF  Dielectric: X5R  Voltage: 6.3V  [C0402_BGA]
C?#42  100nF  Dielectric: X5R  Voltage: 10V  [C0201]
C?#43  1uF  Dielectric: X5R  Voltage: 6.3V  [C0201]
C?#44  100nF  Dielectric: X5R  Voltage: 10V  [C0201]
R?#16  240R  Tolerance: 1%  PCB Footprint: R0201  [R0402]
R?#17  240R  Tolerance: 1%  PCB Footprint: R0201  [R0402]
R?#18  240R  Tolerance: 1%  PCB Footprint: R0201  [R0402]
R?#19  240R  Tolerance: 1%  PCB Footprint: R0201  [R0402]
U?#3  RK3588  [BGA1088_23R00X23R00X2R00]  (part A of 26)
U?#4  RK3588  [BGA1088_23R00X23R00X2R00]  (part B of 26)

### Ports
DDR_CH0_A0_A (out, see DRAM_LPDDR4X_200P_2X32bit[1B]), DDR_CH0_A0_B (out, see DRAM_LPDDR4X_200P_2X32bit[2B]), DDR_CH0_A1_A (out, see DRAM_LPDDR4X_200P_2X32bit[1B]), DDR_CH0_A1_B (out, see DRAM_LPDDR4X_200P_2X32bit[2B]), DDR_CH0_A2_A (out, see DRAM_LPDDR4X_200P_2X32bit[1B]), DDR_CH0_A2_B (out, see DRAM_LPDDR4X_200P_2X32bit[2B]), DDR_CH0_A3_A (out, see DRAM_LPDDR4X_200P_2X32bit[1B]), DDR_CH0_A3_B (out, see DRAM_LPDDR4X_200P_2X32bit[2B]), DDR_CH0_A4_A (out, see DRAM_LPDDR4X_200P_2X32bit[1B]), DDR_CH0_A4_B (out, see DRAM_LPDDR4X_200P_2X32bit[2B]), DDR_CH0_A5_A (out, see DRAM_LPDDR4X_200P_2X32bit[1B]), DDR_CH0_A5_B (out, see DRAM_LPDDR4X_200P_2X32bit[2B]), DDR_CH0_CLKN_A (out, see DRAM_LPDDR4X_200P_2X32bit[1B]), DDR_CH0_CLKN_B (out, see DRAM_LPDDR4X_200P_2X32bit[2B]), DDR_CH0_CLKP_A (out, see DRAM_LPDDR4X_200P_2X32bit[1B]), DDR_CH0_CLKP_B (out, see DRAM_LPDDR4X_200P_2X32bit[2B]), DDR_CH0_DM0_A (out, see DRAM_LPDDR4X_200P_2X32bit[1A]), DDR_CH0_DM0_B (out, see DRAM_LPDDR4X_200P_2X32bit[2A]), DDR_CH0_DM1_A (out, see DRAM_LPDDR4X_200P_2X32bit[1B]), DDR_CH0_DM1_B (out, see DRAM_LPDDR4X_200P_2X32bit[2B]), DDR_CH0_DQ0_A (see DRAM_LPDDR4X_200P_2X32bit[1A]), DDR_CH0_DQ0_B (see DRAM_LPDDR4X_200P_2X32bit[2A]), DDR_CH0_DQ1_A (see DRAM_LPDDR4X_200P_2X32bit[1A]), DDR_CH0_DQ1_B (see DRAM_LPDDR4X_200P_2X32bit[2A]), DDR_CH0_DQ2_A (see DRAM_LPDDR4X_200P_2X32bit[1A]), DDR_CH0_DQ2_B (see DRAM_LPDDR4X_200P_2X32bit[2A]), DDR_CH0_DQ3_A (see DRAM_LPDDR4X_200P_2X32bit[1A]), DDR_CH0_DQ3_B (see DRAM_LPDDR4X_200P_2X32bit[2A]), DDR_CH0_DQ4_A (see DRAM_LPDDR4X_200P_2X32bit[1A]), DDR_CH0_DQ4_B (see DRAM_LPDDR4X_200P_2X32bit[2A]), DDR_CH0_DQ5_A (see DRAM_LPDDR4X_200P_2X32bit[1A]), DDR_CH0_DQ5_B (see DRAM_LPDDR4X_200P_2X32bit[2A]), DDR_CH0_DQ6_A (see DRAM_LPDDR4X_200P_2X32bit[1A]), DDR_CH0_DQ6_B (see DRAM_LPDDR4X_200P_2X32bit[2A]), DDR_CH0_DQ7_A (see DRAM_LPDDR4X_200P_2X32bit[1A]), DDR_CH0_DQ7_B (see DRAM_LPDDR4X_200P_2X32bit[2A]), DDR_CH0_DQ8_A (see DRAM_LPDDR4X_200P_2X32bit[1A]), DDR_CH0_DQ8_B (see DRAM_LPDDR4X_200P_2X32bit[2A]), DDR_CH0_DQ9_A (see DRAM_LPDDR4X_200P_2X32bit[1A]), DDR_CH0_DQ9_B (see DRAM_LPDDR4X_200P_2X32bit[2A]), DDR_CH0_DQ10_A (see DRAM_LPDDR4X_200P_2X32bit[1A]), DDR_CH0_DQ10_B (see DRAM_LPDDR4X_200P_2X32bit[2A]), DDR_CH0_DQ11_A (see DRAM_LPDDR4X_200P_2X32bit[1A]), DDR_CH0_DQ11_B (see DRAM_LPDDR4X_200P_2X32bit[2A]), DDR_CH0_DQ12_A (see DRAM_LPDDR4X_200P_2X32bit[1A]), DDR_CH0_DQ12_B (see DRAM_LPDDR4X_200P_2X32bit[2A]), DDR_CH0_DQ13_A (see DRAM_LPDDR4X_200P_2X32bit[1A]), DDR_CH0_DQ13_B (see DRAM_LPDDR4X_200P_2X32bit[2A]), DDR_CH0_DQ14_A (see DRAM_LPDDR4X_200P_2X32bit[1A]), DDR_CH0_DQ14_B (see DRAM_LPDDR4X_200P_2X32bit[2A]), DDR_CH0_DQ15_A (see DRAM_LPDDR4X_200P_2X32bit[1A]), DDR_CH0_DQ15_B (see DRAM_LPDDR4X_200P_2X32bit[2A]), DDR_CH0_DQS0N_A (see DRAM_LPDDR4X_200P_2X32bit[1A]), DDR_CH0_DQS0N_B (see DRAM_LPDDR4X_200P_2X32bit[2A]), DDR_CH0_DQS0P_A (see DRAM_LPDDR4X_200P_2X32bit[1A]), DDR_CH0_DQS0P_B (see DRAM_LPDDR4X_200P_2X32bit[2A]), DDR_CH0_DQS1N_A (see DRAM_LPDDR4X_200P_2X32bit[1B]), DDR_CH0_DQS1N_B (see DRAM_LPDDR4X_200P_2X32bit[2B]), DDR_CH0_DQS1P_A (see DRAM_LPDDR4X_200P_2X32bit[1B]), DDR_CH0_DQS1P_B (see DRAM_LPDDR4X_200P_2X32bit[2B]), DDR_CH0_LP4/4X_CKE0/LP5_CS0_A (out, see DRAM_LPDDR4X_200P_2X32bit[3B]), DDR_CH0_LP4/4X_CKE0/LP5_CS0_B (out, see DRAM_LPDDR4X_200P_2X32bit[3B]), DDR_CH0_LP4/4X_CKE1/LP5_CS1_A (out, see DRAM_LPDDR4X_200P_2X32bit[3B]), DDR_CH0_LP4/4X_CKE1/LP5_CS1_B (out, see DRAM_LPDDR4X_200P_2X32bit[3B]), DDR_CH0_LP4/4X_CS0_A (out, see DRAM_LPDDR4X_200P_2X32bit[1B]), DDR_CH0_LP4/4X_CS0_B (out, see DRAM_LPDDR4X_200P_2X32bit[2B]), DDR_CH0_LP4/4X_CS1_A (out, see DRAM_LPDDR4X_200P_2X32bit[1B]), DDR_CH0_LP4/4X_CS1_B (out, see DRAM_LPDDR4X_200P_2X32bit[2B]), DDR_CH1_A0_C (out, see DRAM_LPDDR4X_200P_2X32bit[1C]), DDR_CH1_A0_D (out, see DRAM_LPDDR4X_200P_2X32bit[2C]), DDR_CH1_A1_C (out, see DRAM_LPDDR4X_200P_2X32bit[1C]), DDR_CH1_A1_D (out, see DRAM_LPDDR4X_200P_2X32bit[2C]), DDR_CH1_A2_C (out, see DRAM_LPDDR4X_200P_2X32bit[1C]), DDR_CH1_A2_D (out, see DRAM_LPDDR4X_200P_2X32bit[2C]), DDR_CH1_A3_C (out, see DRAM_LPDDR4X_200P_2X32bit[1C]), DDR_CH1_A3_D (out, see DRAM_LPDDR4X_200P_2X32bit[2C]), DDR_CH1_A4_C (out, see DRAM_LPDDR4X_200P_2X32bit[1C]), DDR_CH1_A4_D (out, see DRAM_LPDDR4X_200P_2X32bit[2C]), DDR_CH1_A5_C (out, see DRAM_LPDDR4X_200P_2X32bit[1D]), DDR_CH1_A5_D (out, see DRAM_LPDDR4X_200P_2X32bit[2D]), DDR_CH1_CLKN_C (out, see DRAM_LPDDR4X_200P_2X32bit[1D]), DDR_CH1_CLKN_D (out, see DRAM_LPDDR4X_200P_2X32bit[2D]), DDR_CH1_CLKP_C (out, see DRAM_LPDDR4X_200P_2X32bit[1D]), DDR_CH1_CLKP_D (out, see DRAM_LPDDR4X_200P_2X32bit[2D]), DDR_CH1_DM0_C (out, see DRAM_LPDDR4X_200P_2X32bit[1C]), DDR_CH1_DM0_D (out, see DRAM_LPDDR4X_200P_2X32bit[2C]), DDR_CH1_DM1_C (out, see DRAM_LPDDR4X_200P_2X32bit[1C]), DDR_CH1_DM1_D (out, see DRAM_LPDDR4X_200P_2X32bit[2C]), DDR_CH1_DQ0_C (see DRAM_LPDDR4X_200P_2X32bit[1C]), DDR_CH1_DQ0_D (see DRAM_LPDDR4X_200P_2X32bit[2C]), DDR_CH1_DQ1_C (see DRAM_LPDDR4X_200P_2X32bit[1C]), DDR_CH1_DQ1_D (see DRAM_LPDDR4X_200P_2X32bit[2C]), DDR_CH1_DQ2_C (see DRAM_LPDDR4X_200P_2X32bit[1C]), DDR_CH1_DQ2_D (see DRAM_LPDDR4X_200P_2X32bit[2C]), DDR_CH1_DQ3_C (see DRAM_LPDDR4X_200P_2X32bit[1C]), DDR_CH1_DQ3_D (see DRAM_LPDDR4X_200P_2X32bit[2C]), DDR_CH1_DQ4_C (see DRAM_LPDDR4X_200P_2X32bit[1C]), DDR_CH1_DQ4_D (see DRAM_LPDDR4X_200P_2X32bit[2C]), DDR_CH1_DQ5_C (see DRAM_LPDDR4X_200P_2X32bit[1C]), DDR_CH1_DQ5_D (see DRAM_LPDDR4X_200P_2X32bit[2C]), DDR_CH1_DQ6_C (see DRAM_LPDDR4X_200P_2X32bit[1C]), DDR_CH1_DQ6_D (see DRAM_LPDDR4X_200P_2X32bit[2C]), DDR_CH1_DQ7_C (see DRAM_LPDDR4X_200P_2X32bit[1C]), DDR_CH1_DQ7_D (see DRAM_LPDDR4X_200P_2X32bit[2C]), DDR_CH1_DQ8_C (see DRAM_LPDDR4X_200P_2X32bit[1C]), DDR_CH1_DQ8_D (see DRAM_LPDDR4X_200P_2X32bit[2C]), DDR_CH1_DQ9_C (see DRAM_LPDDR4X_200P_2X32bit[1C]), DDR_CH1_DQ9_D (see DRAM_LPDDR4X_200P_2X32bit[2C]), DDR_CH1_DQ10_C (see DRAM_LPDDR4X_200P_2X32bit[1C]), DDR_CH1_DQ10_D (see DRAM_LPDDR4X_200P_2X32bit[2C]), DDR_CH1_DQ11_C (see DRAM_LPDDR4X_200P_2X32bit[1C]), DDR_CH1_DQ11_D (see DRAM_LPDDR4X_200P_2X32bit[2C]), DDR_CH1_DQ12_C (see DRAM_LPDDR4X_200P_2X32bit[1C]), DDR_CH1_DQ12_D (see DRAM_LPDDR4X_200P_2X32bit[2C]), DDR_CH1_DQ13_C (see DRAM_LPDDR4X_200P_2X32bit[1C]), DDR_CH1_DQ13_D (see DRAM_LPDDR4X_200P_2X32bit[2C]), DDR_CH1_DQ14_C (see DRAM_LPDDR4X_200P_2X32bit[1C]), DDR_CH1_DQ14_D (see DRAM_LPDDR4X_200P_2X32bit[2C]), DDR_CH1_DQ15_C (see DRAM_LPDDR4X_200P_2X32bit[1C]), DDR_CH1_DQ15_D (see DRAM_LPDDR4X_200P_2X32bit[2C]), DDR_CH1_DQS0N_C (see DRAM_LPDDR4X_200P_2X32bit[1C]), DDR_CH1_DQS0N_D (see DRAM_LPDDR4X_200P_2X32bit[2C]), DDR_CH1_DQS0P_C (see DRAM_LPDDR4X_200P_2X32bit[1C]), DDR_CH1_DQS0P_D (see DRAM_LPDDR4X_200P_2X32bit[2C]), DDR_CH1_DQS1N_C (see DRAM_LPDDR4X_200P_2X32bit[1C]), DDR_CH1_DQS1N_D (see DRAM_LPDDR4X_200P_2X32bit[2C]), DDR_CH1_DQS1P_C (see DRAM_LPDDR4X_200P_2X32bit[1C]), DDR_CH1_DQS1P_D (see DRAM_LPDDR4X_200P_2X32bit[2C]), DDR_CH1_LP4/4X_CKE0/LP5_CS0_C (out, see DRAM_LPDDR4X_200P_2X32bit[3D]), DDR_CH1_LP4/4X_CKE0/LP5_CS0_D (out, see DRAM_LPDDR4X_200P_2X32bit[3D]), DDR_CH1_LP4/4X_CKE1/LP5_CS1_C (out, see DRAM_LPDDR4X_200P_2X32bit[3D]), DDR_CH1_LP4/4X_CKE1/LP5_CS1_D (out, see DRAM_LPDDR4X_200P_2X32bit[3D]), DDR_CH1_LP4/4X_CS0_C (out, see DRAM_LPDDR4X_200P_2X32bit[1D]), DDR_CH1_LP4/4X_CS0_D (out, see DRAM_LPDDR4X_200P_2X32bit[2D]), DDR_CH1_LP4/4X_CS1_C (out, see DRAM_LPDDR4X_200P_2X32bit[1D]), DDR_CH1_LP4/4X_CS1_D (out, see DRAM_LPDDR4X_200P_2X32bit[2D]), DDR_RESET (out, see DRAM_LPDDR4X_200P_2X32bit[2B])

### Nets
(0.75-0.85V): C?#30.1 C?#34.1 U?#3.N12(DDR_CH0_PLL_DVDD) U?#4.L15(DDR_CH1_PLL_DVDD)  [also labelled VDDA_DDR_PLL_S0]
GND: C?#14.2 C?#15.2 C?#16.2 C?#17.2 C?#18.2 C?#19.2 C?#20.2 C?#21.2 C?#22.2 C?#23.2 C?#24.2 C?#25.2 C?#26.2 C?#27.2 C?#28.2 C?#29.2 C?#30.2 C?#31.2 C?#32.2 C?#33.2 C?#34.2 C?#35.2 C?#36.2 C?#37.2 C?#38.2 C?#39.2 C?#40.2 C?#41.2 C?#42.2 C?#43.2 C?#44.2 U?#3.M11(DDR_CH0_PLL_AVSS) U?#4.L16(DDR_CH1_PLL_AVSS)
VCCA_1V8_S0: C?#29.1 C?#33.1 U?#3.M12(DDR_CH0_PLL_AVDD1V8) U?#4.K16(DDR_CH1_PLL_AVDD1V8)
VDD_DDR_S0: C?#35.1 C?#36.1 C?#37.1 C?#38.1 C?#39.1 C?#40.1 C?#41.1 C?#42.1 C?#43.1 C?#44.1 U?#3.N13(DDR_CH0_VDD_MIF_0) U?#3.P12(DDR_CH0_VDD_3) U?#3.P13(DDR_CH0_VDD_MIF_1) U?#3.R12(DDR_CH0_VDD_2) U?#3.T12(DDR_CH0_VDD_1) U?#3.U11(DDR_CH0_VDD_0) U?#4.L11(DDR_CH1_VDD_0) U?#4.L12(DDR_CH1_VDD_1) U?#4.L13(DDR_CH1_VDD_2) U?#4.L14(DDR_CH1_VDD_3) U?#4.L17(DDR_CH1_VDD_MIF_0) U?#4.L18(DDR_CH1_VDD_MIF_1)
VDDQ_DDR_CK_S0: C?#20.1 C?#27.1 C?#28.1 U?#3.L10(DDR_CH0_VDDQ_CK) U?#4.M13(DDR_CH1_VDDQ_CK)
VDDQ_DDR_CKE_S3: C?#31.1 C?#32.1 U?#3.N8(DDR_CH0_VDDQ_CKE) U?#4.H13(DDR_CH1_VDDQ_CKE)
VDDQ_DDR_S0: C?#14.1 C?#15.1 C?#16.1 C?#17.1 C?#18.1 C?#19.1 C?#21.1 C?#22.1 C?#23.1 C?#24.1 C?#25.1 C?#26.1 R?#16.2 R?#17.2 R?#18.2 R?#19.2 U?#3.M10(DDR_CH0_VDDQ_0) U?#3.N10(DDR_CH0_VDDQ_1) U?#3.P10(DDR_CH0_VDDQ_2) U?#3.R10(DDR_CH0_VDDQ_3) U?#3.T10(DDR_CH0_VDDQ_4) U?#4.K11(DDR_CH1_VDDQ_0) U?#4.K12(DDR_CH1_VDDQ_1) U?#4.K13(DDR_CH1_VDDQ_2) U?#4.K14(DDR_CH1_VDDQ_3) U?#4.K15(DDR_CH1_VDDQ_4)
DDR_RESET: U?#3.T4(DDR_CH0_RESET_A) ; port DDR_RESET
NetR?#16_1: R?#16.1 U?#3.W8(DDR_CH0_ZQ_A)
NetR?#17_1: R?#17.1 U?#4.G8(DDR_CH1_ZQ_C)
NetR?#18_1: R?#18.1 U?#3.H7(DDR_CH0_ZQ_B)
NetR?#19_1: R?#19.1 U?#4.F18(DDR_CH1_ZQ_D)
NetR?#85_1: U?#3.P7(DDR_CH0_LP4/4X_CKE0/LP5_CS0_A) ; port DDR_CH0_LP4/4X_CKE0/LP5_CS0_A
NetR?#86_1: U?#3.N7(DDR_CH0_LP4/4X_CKE1/LP5_CS1_A) ; port DDR_CH0_LP4/4X_CKE1/LP5_CS1_A
NetR?#87_1: U?#3.L5(DDR_CH0_LP4/4X_CKE0/LP5_CS0_B) ; port DDR_CH0_LP4/4X_CKE0/LP5_CS0_B
NetR?#88_1: U?#3.L4(DDR_CH0_LP4/4X_CKE1/LP5_CS1_B) ; port DDR_CH0_LP4/4X_CKE1/LP5_CS1_B
NetR?#97_1: U?#4.D11(DDR_CH1_LP4/4X_CKE0/LP5_CS0_C) ; port DDR_CH1_LP4/4X_CKE0/LP5_CS0_C
NetR?#98_1: U?#4.E11(DDR_CH1_LP4/4X_CKE1/LP5_CS1_C) ; port DDR_CH1_LP4/4X_CKE1/LP5_CS1_C
NetR?#99_1: U?#4.D16(DDR_CH1_LP4/4X_CKE0/LP5_CS0_D) ; port DDR_CH1_LP4/4X_CKE0/LP5_CS0_D
NetR?#100_1: U?#4.E16(DDR_CH1_LP4/4X_CKE1/LP5_CS1_D) ; port DDR_CH1_LP4/4X_CKE1/LP5_CS1_D
NetU?#3_AA1: U?#3.AA1(DDR_CH0_DQ14_A) ; port DDR_CH0_DQ14_A
NetU?#3_AA2: U?#3.AA2(DDR_CH0_DQ15_A) ; port DDR_CH0_DQ15_A
NetU?#3_AA4: U?#3.AA4(DDR_CH0_DQS1N_A) ; port DDR_CH0_DQS1N_A
NetU?#3_AA5: U?#3.AA5(DDR_CH0_DQS1P_A) ; port DDR_CH0_DQS1P_A
NetU?#3_AB1: U?#3.AB1(DDR_CH0_DQ9_A) ; port DDR_CH0_DQ9_A
NetU?#3_AB2: U?#3.AB2(DDR_CH0_DQ8_A) ; port DDR_CH0_DQ8_A
NetU?#3_AB4: U?#3.AB4(DDR_CH0_DM1_A) ; port DDR_CH0_DM1_A
NetU?#3_AC1: U?#3.AC1(DDR_CH0_DQ10_A) ; port DDR_CH0_DQ10_A
NetU?#3_AC2: U?#3.AC2(DDR_CH0_DQ11_A) ; port DDR_CH0_DQ11_A
NetU?#3_B1: U?#3.B1(DDR_CH0_DQ11_B) ; port DDR_CH0_DQ11_B
NetU?#3_C1: U?#3.C1(DDR_CH0_DQ9_B) ; port DDR_CH0_DQ9_B
NetU?#3_C2: U?#3.C2(DDR_CH0_DQ10_B) ; port DDR_CH0_DQ10_B
NetU?#3_D1: U?#3.D1(DDR_CH0_DQ15_B) ; port DDR_CH0_DQ15_B
NetU?#3_D2: U?#3.D2(DDR_CH0_DQ8_B) ; port DDR_CH0_DQ8_B
NetU?#3_E1: U?#3.E1(DDR_CH0_DQ13_B) ; port DDR_CH0_DQ13_B
NetU?#3_E2: U?#3.E2(DDR_CH0_DQ14_B) ; port DDR_CH0_DQ14_B
NetU?#3_E4: U?#3.E4(DDR_CH0_DM1_B) ; port DDR_CH0_DM1_B
NetU?#3_F1: U?#3.F1(DDR_CH0_DQ4_B) ; port DDR_CH0_DQ4_B
NetU?#3_F2: U?#3.F2(DDR_CH0_DQ12_B) ; port DDR_CH0_DQ12_B
NetU?#3_F4: U?#3.F4(DDR_CH0_DQS1N_B) ; port DDR_CH0_DQS1N_B
NetU?#3_F5: U?#3.F5(DDR_CH0_DQS1P_B) ; port DDR_CH0_DQS1P_B
NetU?#3_G1: U?#3.G1(DDR_CH0_DQ6_B) ; port DDR_CH0_DQ6_B
NetU?#3_G2: U?#3.G2(DDR_CH0_DQ5_B) ; port DDR_CH0_DQ5_B
NetU?#3_G4: U?#3.G4(DDR_CH0_DM0_B) ; port DDR_CH0_DM0_B
NetU?#3_H1: U?#3.H1(DDR_CH0_DQ0_B) ; port DDR_CH0_DQ0_B
NetU?#3_H2: U?#3.H2(DDR_CH0_DQ7_B) ; port DDR_CH0_DQ7_B
NetU?#3_J1: U?#3.J1(DDR_CH0_DQ2_B) ; port DDR_CH0_DQ2_B
NetU?#3_J2: U?#3.J2(DDR_CH0_DQ1_B) ; port DDR_CH0_DQ1_B
NetU?#3_J7: U?#3.J7(DDR_CH0_DQS0N_B) ; port DDR_CH0_DQS0N_B
NetU?#3_J8: U?#3.J8(DDR_CH0_DQS0P_B) ; port DDR_CH0_DQS0P_B
NetU?#3_K1: U?#3.K1(DDR_CH0_A4_B) ; port DDR_CH0_A4_B
NetU?#3_K2: U?#3.K2(DDR_CH0_DQ3_B) ; port DDR_CH0_DQ3_B
NetU?#3_L2: U?#3.L2(DDR_CH0_A5_B) ; port DDR_CH0_A5_B
NetU?#3_L7: U?#3.L7(DDR_CH0_LP4/4X_CS0_B) ; port DDR_CH0_LP4/4X_CS0_B
NetU?#3_L8: U?#3.L8(DDR_CH0_LP4/4X_CS1_B) ; port DDR_CH0_LP4/4X_CS1_B
NetU?#3_M1: U?#3.M1(DDR_CH0_CKB_B) ; port DDR_CH0_CLKN_B
NetU?#3_M2: U?#3.M2(DDR_CH0_CK_B) ; port DDR_CH0_CLKP_B
NetU?#3_M5: U?#3.M5(DDR_CH0_A1_B) ; port DDR_CH0_A1_B
NetU?#3_M8: U?#3.M8(DDR_CH0_A0_B) ; port DDR_CH0_A0_B
NetU?#3_N1: U?#3.N1(DDR_CH0_CKB_A) ; port DDR_CH0_CLKN_A
NetU?#3_N2: U?#3.N2(DDR_CH0_CK_A) ; port DDR_CH0_CLKP_A
NetU?#3_N4: U?#3.N4(DDR_CH0_A3_B) ; port DDR_CH0_A3_B
NetU?#3_N5: U?#3.N5(DDR_CH0_A2_B) ; port DDR_CH0_A2_B
NetU?#3_P2: U?#3.P2(DDR_CH0_A5_A) ; port DDR_CH0_A5_A
NetU?#3_P4: U?#3.P4(DDR_CH0_A2_A) ; port DDR_CH0_A2_A
NetU?#3_P5: U?#3.P5(DDR_CH0_A3_A) ; port DDR_CH0_A3_A
NetU?#3_R1: U?#3.R1(DDR_CH0_A4_A) ; port DDR_CH0_A4_A
NetU?#3_R2: U?#3.R2(DDR_CH0_DQ3_A) ; port DDR_CH0_DQ3_A
NetU?#3_R6: U?#3.R6(DDR_CH0_LP4/4X_CS0_A) ; port DDR_CH0_LP4/4X_CS0_A
NetU?#3_R7: U?#3.R7(DDR_CH0_LP4/4X_CS1_A) ; port DDR_CH0_LP4/4X_CS1_A
NetU?#3_T1: U?#3.T1(DDR_CH0_DQ2_A) ; port DDR_CH0_DQ2_A
NetU?#3_T2: U?#3.T2(DDR_CH0_DQ1_A) ; port DDR_CH0_DQ1_A
NetU?#3_T7: U?#3.T7(DDR_CH0_A0_A) ; port DDR_CH0_A0_A
NetU?#3_T8: U?#3.T8(DDR_CH0_A1_A) ; port DDR_CH0_A1_A
NetU?#3_U1: U?#3.U1(DDR_CH0_DQ0_A) ; port DDR_CH0_DQ0_A
NetU?#3_U2: U?#3.U2(DDR_CH0_DQ7_A) ; port DDR_CH0_DQ7_A
NetU?#3_U4: U?#3.U4(DDR_CH0_DQS0N_A) ; port DDR_CH0_DQS0N_A
NetU?#3_U5: U?#3.U5(DDR_CH0_DQS0P_A) ; port DDR_CH0_DQS0P_A
NetU?#3_V1: U?#3.V1(DDR_CH0_DQ6_A) ; port DDR_CH0_DQ6_A
NetU?#3_V2: U?#3.V2(DDR_CH0_DQ5_A) ; port DDR_CH0_DQ5_A
NetU?#3_W1: U?#3.W1(DDR_CH0_DQ4_A) ; port DDR_CH0_DQ4_A
NetU?#3_Y1: U?#3.Y1(DDR_CH0_DQ12_A) ; port DDR_CH0_DQ12_A
NetU?#3_Y2: U?#3.Y2(DDR_CH0_DQ13_A) ; port DDR_CH0_DQ13_A
NetU?#3_Y4: U?#3.Y4(DDR_CH0_DM0_A) ; port DDR_CH0_DM0_A
NetU?#4_A2: U?#4.A2(DDR_CH1_DQ10_C) ; port DDR_CH1_DQ10_C
NetU?#4_A3: U?#4.A3(DDR_CH1_DQ8_C) ; port DDR_CH1_DQ8_C
NetU?#4_A4: U?#4.A4(DDR_CH1_DQ14_C) ; port DDR_CH1_DQ14_C
NetU?#4_A5: U?#4.A5(DDR_CH1_DQ12_C) ; port DDR_CH1_DQ12_C
NetU?#4_A6: U?#4.A6(DDR_CH1_DQ4_C) ; port DDR_CH1_DQ4_C
NetU?#4_A7: U?#4.A7(DDR_CH1_DQ6_C) ; port DDR_CH1_DQ6_C
NetU?#4_A8: U?#4.A8(DDR_CH1_DQ0_C) ; port DDR_CH1_DQ0_C
NetU?#4_A9: U?#4.A9(DDR_CH1_DQ2_C) ; port DDR_CH1_DQ2_C
NetU?#4_A10: U?#4.A10(DDR_CH1_A4_C) ; port DDR_CH1_A4_C
NetU?#4_A12: U?#4.A12(DDR_CH1_CKB_C) ; port DDR_CH1_CLKN_C
NetU?#4_A13: U?#4.A13(DDR_CH1_CKB_D) ; port DDR_CH1_CLKN_D
NetU?#4_A15: U?#4.A15(DDR_CH1_A4_D) ; port DDR_CH1_A4_D
NetU?#4_A16: U?#4.A16(DDR_CH1_DQ2_D) ; port DDR_CH1_DQ2_D
NetU?#4_A17: U?#4.A17(DDR_CH1_DQ0_D) ; port DDR_CH1_DQ0_D
NetU?#4_A18: U?#4.A18(DDR_CH1_DQ6_D) ; port DDR_CH1_DQ6_D
NetU?#4_A19: U?#4.A19(DDR_CH1_DQ4_D) ; port DDR_CH1_DQ4_D
NetU?#4_A20: U?#4.A20(DDR_CH1_DQ12_D) ; port DDR_CH1_DQ12_D
NetU?#4_A21: U?#4.A21(DDR_CH1_DQ14_D) ; port DDR_CH1_DQ14_D
NetU?#4_A22: U?#4.A22(DDR_CH1_DQ8_D) ; port DDR_CH1_DQ8_D
NetU?#4_A23: U?#4.A23(DDR_CH1_DQ10_D) ; port DDR_CH1_DQ10_D
NetU?#4_B2: U?#4.B2(DDR_CH1_DQ11_C) ; port DDR_CH1_DQ11_C
NetU?#4_B3: U?#4.B3(DDR_CH1_DQ9_C) ; port DDR_CH1_DQ9_C
NetU?#4_B4: U?#4.B4(DDR_CH1_DQ15_C) ; port DDR_CH1_DQ15_C
NetU?#4_B5: U?#4.B5(DDR_CH1_DQ13_C) ; port DDR_CH1_DQ13_C
NetU?#4_B7: U?#4.B7(DDR_CH1_DQ5_C) ; port DDR_CH1_DQ5_C
NetU?#4_B8: U?#4.B8(DDR_CH1_DQ7_C) ; port DDR_CH1_DQ7_C
NetU?#4_B9: U?#4.B9(DDR_CH1_DQ1_C) ; port DDR_CH1_DQ1_C
NetU?#4_B10: U?#4.B10(DDR_CH1_DQ3_C) ; port DDR_CH1_DQ3_C
NetU?#4_B11: U?#4.B11(DDR_CH1_A5_C) ; port DDR_CH1_A5_C
NetU?#4_B12: U?#4.B12(DDR_CH1_CK_C) ; port DDR_CH1_CLKP_C
NetU?#4_B13: U?#4.B13(DDR_CH1_CK_D) ; port DDR_CH1_CLKP_D
NetU?#4_B14: U?#4.B14(DDR_CH1_A5_D) ; port DDR_CH1_A5_D
NetU?#4_B15: U?#4.B15(DDR_CH1_DQ3_D) ; port DDR_CH1_DQ3_D
NetU?#4_B16: U?#4.B16(DDR_CH1_DQ1_D) ; port DDR_CH1_DQ1_D
NetU?#4_B17: U?#4.B17(DDR_CH1_DQ7_D) ; port DDR_CH1_DQ7_D
NetU?#4_B18: U?#4.B18(DDR_CH1_DQ5_D) ; port DDR_CH1_DQ5_D
NetU?#4_B20: U?#4.B20(DDR_CH1_DQ13_D) ; port DDR_CH1_DQ13_D
NetU?#4_B21: U?#4.B21(DDR_CH1_DQ15_D) ; port DDR_CH1_DQ15_D
NetU?#4_B22: U?#4.B22(DDR_CH1_DQ9_D) ; port DDR_CH1_DQ9_D
NetU?#4_B23: U?#4.B23(DDR_CH1_DQ11_D) ; port DDR_CH1_DQ11_D
NetU?#4_D4: U?#4.D4(DDR_CH1_DM1_C) ; port DDR_CH1_DM1_C
NetU?#4_D5: U?#4.D5(DDR_CH1_DQS1N_C) ; port DDR_CH1_DQS1N_C
NetU?#4_D9: U?#4.D9(DDR_CH1_DQS0N_C) ; port DDR_CH1_DQS0N_C
NetU?#4_D13: U?#4.D13(DDR_CH1_A3_C) ; port DDR_CH1_A3_C
NetU?#4_D19: U?#4.D19(DDR_CH1_LP4/4X_CS1_D) ; port DDR_CH1_LP4/4X_CS1_D
NetU?#4_D20: U?#4.D20(DDR_CH1_DM0_D) ; port DDR_CH1_DM0_D
NetU?#4_D21: U?#4.D21(DDR_CH1_DQS1P_D) ; port DDR_CH1_DQS1P_D
NetU?#4_D22: U?#4.D22(DDR_CH1_DM1_D) ; port DDR_CH1_DM1_D
NetU?#4_E5: U?#4.E5(DDR_CH1_DQS1P_C) ; port DDR_CH1_DQS1P_C
NetU?#4_E9: U?#4.E9(DDR_CH1_DQS0P_C) ; port DDR_CH1_DQS0P_C
NetU?#4_E13: U?#4.E13(DDR_CH1_A2_C) ; port DDR_CH1_A2_C
NetU?#4_E14: U?#4.E14(DDR_CH1_A3_D) ; port DDR_CH1_A3_D
NetU?#4_E19: U?#4.E19(DDR_CH1_LP4/4X_CS0_D) ; port DDR_CH1_LP4/4X_CS0_D
NetU?#4_E21: U?#4.E21(DDR_CH1_DQS1N_D) ; port DDR_CH1_DQS1N_D
NetU?#4_F8: U?#4.F8(DDR_CH1_DM0_C) ; port DDR_CH1_DM0_C
NetU?#4_F12: U?#4.F12(DDR_CH1_A1_C) ; port DDR_CH1_A1_C
NetU?#4_G11: U?#4.G11(DDR_CH1_LP4/4X_CS0_C) ; port DDR_CH1_LP4/4X_CS0_C
NetU?#4_G12: U?#4.G12(DDR_CH1_A0_C) ; port DDR_CH1_A0_C
NetU?#4_G13: U?#4.G13(DDR_CH1_A2_D) ; port DDR_CH1_A2_D
NetU?#4_G14: U?#4.G14(DDR_CH1_A1_D) ; port DDR_CH1_A1_D
NetU?#4_G16: U?#4.G16(DDR_CH1_DQS0N_D) ; port DDR_CH1_DQS0N_D
NetU?#4_H11: U?#4.H11(DDR_CH1_LP4/4X_CS1_C) ; port DDR_CH1_LP4/4X_CS1_C
NetU?#4_H15: U?#4.H15(DDR_CH1_A0_D) ; port DDR_CH1_A0_D
NetU?#4_H16: U?#4.H16(DDR_CH1_DQS0P_D) ; port DDR_CH1_DQS0P_D

Not connected (* = marked no-connect by the designer): U?#3 H4(DDR_CH0_WCK1P_B) H5(DDR_CH0_WCK1N_B) K4(DDR_CH0_WCK0N_B) K5(DDR_CH0_WCK0P_B) K7(DDR_CH0_RESET_B) M7(DDR_CH0_A6_B) T5(DDR_CH0_A6_A) V6(DDR_CH0_WCK0N_A) V7(DDR_CH0_WCK0P_A) W4(DDR_CH0_WCK1P_A) W5(DDR_CH0_WCK1N_A); U?#4 C19(DDR_CH1_RESET_D) D7(DDR_CH1_WCK1P_C) D10(DDR_CH1_A6_C) D14(DDR_CH1_A6_D) D17(DDR_CH1_WCK0N_D) E7(DDR_CH1_WCK1N_C) E10(DDR_CH1_RESET_C) E17(DDR_CH1_WCK0P_D) G9(DDR_CH1_WCK0P_C) G18(DDR_CH1_WCK1N_D) H9(DDR_CH1_WCK0N_C) H18(DDR_CH1_WCK1P_D)

### Notes on the sheet
- ZQ:Calibrates the output and termination
  impedance and passes throughe impedance
  control signals to each I/O cells
- DDR Differential Pair:
  80  Ohm +-10%
- DDR Single:
  40 Ohm +-10%
- DDR FILTER
- (near U?#4) WCK:DRAM write data strobe for LPDDR5.
  DQS:DRAM data strobe for LPDDR4X/4
  or DRAM read strobe(RDQS) for LPDDR5.
- Hold power of CLK during
  retention times.
- Close pin L10
- Sequence:
  VDD-VDDQ_CKE-VDDQ
- Close pin M13
- (near C?#33) VDDQ_LP4/4X_CKE/LP5_CS:
  power for LP4_CKE/LP5_CS and RESET,
  lpddr4X=1.1V/lpddr5=1.05V
  VDDQ_CK:power for CK,
  LPDDR4/4X=0.6V/LPDDR5=0.5V
  VDDQ:Power for DDR IO(except for ck,
  cke and reset);
  LPDDR4/4X=0.6V/LPDDR5=0.5V
- 420x594
- Формат А2
- (in symbol SOC_RK3588, part A) DDR_PLL POWER; LP4/4X_CKE&LP5_CS & Reset Power; 0.75V-0.85V; 1.8V; LPDDR4/4X=1.1V / LPDDR5=1.05V; MEMORY INTERFACE POWER; CK Power; LPDDR4/4X=0.6V / LPDDR5=0.5V; DIGITAL CORE POWER; DDR IO POWER; (Except for ck, / cke and reset)
- (in symbol SOC_RK3588, part B) DDR_PLL POWER; LP4/4X_CKE&LP5_CS & Reset Power; 0.75V-0.85V; 1.8V; LPDDR4/4X=1.1V / LPDDR5=1.05V; MEMORY INTERFACE POWER; CK Power; LPDDR4/4X=0.6V / LPDDR5=0.5V; DIGITAL CORE POWER; DDR IO POWER; (Except for ck, / cke and reset)

### Library data of the parts
C?#14 = CAP NP_Dup1: cap,10.00uF,+/-20%,4V,X5R,C0402; Part Reference: C1200; Manufacturer PN: CC0402MRX5R4BB106; Manufacturer: YAGEO; Tolerance: 20%; C_Voltage: 6.3V; Priority: A; Value: 10uF; Created by: JJJ; Part Type: C0402; RK PN: CC0402MRX5R4BB106
C?#15 = CAP NP_Dup1: cap,1.00uF,+/-20%,6.3V,X5R,C0201; Part Reference: C1201; Manufacturer PN: C0603X5R0J105M030BC; Manufacturer: TDK; Tolerance: 20%; Priority: A; Value: 1uF; Created by: JJJ; Part Type: C0201; RK PN: C0603X5R0J105M030BC
C?#16 = CAP NP_Dup1: cap,1.00uF,+/-20%,6.3V,X5R,C0201; Part Reference: C1202; Manufacturer: TDK; RK PN: C0603X5R0J105M030BC; Priority: A; Tolerance: 20%; Value: 1uF; Part Type: C0201; Manufacturer PN: C0603X5R0J105M030BC; Created by: JJJ
C?#17 = CAP NP_Dup1: cap,100.00nF,+/-10%,10V,X5R,C0201; Part Reference: C1203; Manufacturer: TDK; RK PN: C0603X5R1A104K030BC; Priority: A; Tolerance: 10%; Value: 100nF; Part Type: C0201; Manufacturer PN: C0603X5R1A104K030BC; Created by: JJJ
C?#18 = CAP NP_Dup1: cap,100.00nF,+/-10%,10V,X5R,C0201; Part Reference: C1204; Manufacturer: TDK; RK PN: C0603X5R1A104K030BC; Priority: A; Tolerance: 10%; Value: 100nF; Part Type: C0201; Manufacturer PN: C0603X5R1A104K030BC; Created by: JJJ
C?#19 = CAP NP_Dup1: cap,100.00nF,+/-10%,10V,X5R,C0201; Part Reference: C1205; Manufacturer: TDK; RK PN: C0603X5R1A104K030BC; Priority: A; Tolerance: 10%; Value: 100nF; Part Type: C0201; Manufacturer PN: C0603X5R1A104K030BC; Created by: JJJ
C?#20 = CAP NP_Dup1: cap,1.00uF,+/-20%,6.3V,X5R,C0201; Part Reference: C1206; Manufacturer PN: C0603X5R0J105M030BC; Manufacturer: TDK; Tolerance: 20%; Priority: A; Value: 1uF; Created by: JJJ; Part Type: C0201; RK PN: C0603X5R0J105M030BC
C?#21 = CAP NP_Dup1: cap,10.00uF,+/-20%,4V,X5R,C0402; Part Reference: C1207; Manufacturer: YAGEO; RK PN: CC0402MRX5R4BB106; Priority: A; C_Voltage: 6.3V; Tolerance: 20%; Value: 10uF; Part Type: C0402; Manufacturer PN: CC0402MRX5R4BB106; Created by: JJJ
C?#22 = CAP NP_Dup1: cap,1.00uF,+/-20%,6.3V,X5R,C0201; Part Reference: C1208; Manufacturer: TDK; RK PN: C0603X5R0J105M030BC; Priority: A; Tolerance: 20%; Value: 1uF; Part Type: C0201; Manufacturer PN: C0603X5R0J105M030BC; Created by: JJJ
C?#23 = CAP NP_Dup1: cap,1.00uF,+/-20%,6.3V,X5R,C0201; Part Reference: C1209; Manufacturer PN: C0603X5R0J105M030BC; Manufacturer: TDK; Tolerance: 20%; Priority: A; Value: 1uF; Created by: JJJ; Part Type: C0201; RK PN: C0603X5R0J105M030BC
C?#24 = CAP NP_Dup1: cap,100.00nF,+/-10%,10V,X5R,C0201; Part Reference: C1210; Manufacturer PN: C0603X5R1A104K030BC; Manufacturer: TDK; Tolerance: 10%; Priority: A; Value: 100nF; Created by: JJJ; Part Type: C0201; RK PN: C0603X5R1A104K030BC
C?#25 = CAP NP_Dup1: cap,100.00nF,+/-10%,10V,X5R,C0201; Part Reference: C1211; Manufacturer PN: C0603X5R1A104K030BC; Manufacturer: TDK; Tolerance: 10%; Priority: A; Value: 100nF; Created by: JJJ; Part Type: C0201; RK PN: C0603X5R1A104K030BC
C?#26 = CAP NP_Dup1: cap,100.00nF,+/-10%,10V,X5R,C0201; Part Reference: C1212; Manufacturer PN: C0603X5R1A104K030BC; Manufacturer: TDK; Tolerance: 10%; Priority: A; Value: 100nF; Created by: JJJ; Part Type: C0201; RK PN: C0603X5R1A104K030BC
C?#27 = CAP NP_Dup1: cap,1.00uF,+/-20%,6.3V,X5R,C0201; Part Reference: C1213; Manufacturer PN: C0603X5R0J105M030BC; Manufacturer: TDK; Tolerance: 20%; Priority: A; PCB Footprint: C0201; Value: 1uF; Created by: JJJ; Part Type: C0201; RK PN: C0603X5R0J105M030BC
C?#28 = CAP NP_Dup1: cap,10.00uF,+/-10%,6.3V,X5R,C0603; Part Reference: C1232; Manufacturer: TDK; RK PN: C1608X5R0J106K080AB; Priority: A; Tolerance: 10%; PCB Footprint: C0603; Value: 10uF; Part Type: C0603; Manufacturer PN: C1608X5R0J106K080AB; Created by: JJJ
C?#29 = CAP NP_Dup1: cap,1.00uF,+/-20%,6.3V,X5R,C0201; Part Reference: C1214; Manufacturer: TDK; RK PN: C0603X5R0J105M030BC; Priority: A; Tolerance: 20%; PCB Footprint: C0201; Value: 1uF; Part Type: C0201; Manufacturer PN: C0603X5R0J105M030BC; Created by: JJJ
C?#30 = CAP NP_Dup1: cap,1.00uF,+/-20%,6.3V,X5R,C0201; Part Reference: C1215; Manufacturer PN: C0603X5R0J105M030BC; Manufacturer: TDK; Tolerance: 20%; Priority: A; PCB Footprint: C0201; Value: 1uF; Created by: JJJ; Part Type: C0201; RK PN: C0603X5R0J105M030BC
C?#31 = CAP NP_Dup1: cap,1.00uF,+/-20%,6.3V,X5R,C0201; Part Reference: C1216; Manufacturer PN: C0603X5R0J105M030BC; Manufacturer: TDK; Tolerance: 20%; Priority: A; Value: 1uF; Created by: JJJ; Part Type: C0201; RK PN: C0603X5R0J105M030BC
C?#32 = CAP NP_Dup1: cap,1.00uF,+/-20%,6.3V,X5R,C0201; Part Reference: C1219; Manufacturer: TDK; RK PN: C0603X5R0J105M030BC; Priority: A; Tolerance: 20%; Value: 1uF; Part Type: C0201; Manufacturer PN: C0603X5R0J105M030BC; Created by: JJJ
C?#33 = CAP NP_Dup1: cap,1.00uF,+/-20%,6.3V,X5R,C0201; Part Reference: C1217; Manufacturer: TDK; RK PN: C0603X5R0J105M030BC; Priority: A; Tolerance: 20%; Value: 1uF; Part Type: C0201; Manufacturer PN: C0603X5R0J105M030BC; Created by: JJJ
C?#34 = CAP NP_Dup1: cap,1.00uF,+/-20%,6.3V,X5R,C0201; Part Reference: C1218; Manufacturer PN: C0603X5R0J105M030BC; Manufacturer: TDK; Tolerance: 20%; Priority: A; Value: 1uF; Created by: JJJ; Part Type: C0201; RK PN: C0603X5R0J105M030BC
C?#35 = CAP NP_Dup1: cap,10.00uF,+/-20%,4V,X5R,C0402; Part Reference: C1220; Manufacturer: YAGEO; RK PN: CC0402MRX5R4BB106; Priority: A; Tolerance: 20%; Value: 10uF; Part Type: C0402; Manufacturer PN: CC0402MRX5R4BB106; Created by: JJJ
C?#36 = CAP NP_Dup1: cap,4.70uF,+/-10%,6.3V,X5R,C0402; Part Reference: C1221; Manufacturer PN: C1005X5R0J475K050BC; Manufacturer: TDK; Tolerance: 10%; Priority: A; Value: 4.7uF; Created by: JJJ; Part Type: C0402; RK PN: C1005X5R0J475K050BC
C?#37 = CAP NP_Dup1: cap,100.00nF,+/-10%,10V,X5R,C0201; Part Reference: C1223; Manufacturer PN: C0603X5R1A104K030BC; Manufacturer: TDK; Tolerance: 10%; Priority: A; Value: 100nF; Created by: JJJ; Part Type: C0201; RK PN: C0603X5R1A104K030BC
C?#38 = CAP NP_Dup1: cap,1.00uF,+/-20%,6.3V,X5R,C0201; Part Reference: C1224; Manufacturer PN: C0603X5R0J105M030BC; Manufacturer: TDK; Tolerance: 20%; Priority: A; PCB Footprint: C0201; Value: 1uF; Created by: JJJ; Part Type: C0201; RK PN: C0603X5R0J105M030BC
C?#39 = CAP NP_Dup1: cap,100.00nF,+/-10%,10V,X5R,C0201; Part Reference: C1225; Manufacturer: TDK; RK PN: C0603X5R1A104K030BC; Priority: A; Tolerance: 10%; PCB Footprint: C0201; Value: 100nF; Part Type: C0201; Manufacturer PN: C0603X5R1A104K030BC; Created by: JJJ
C?#40 = CAP NP_Dup1: cap,10.00uF,+/-20%,4V,X5R,C0402; Part Reference: C1226; Manufacturer PN: CC0402MRX5R4BB106; Manufacturer: YAGEO; Tolerance: 20%; Priority: A; Value: 10uF; Created by: JJJ; Part Type: C0402; RK PN: CC0402MRX5R4BB106
C?#41 = CAP NP_Dup1: cap,4.70uF,+/-10%,6.3V,X5R,C0402; Part Reference: C1227; Manufacturer: TDK; RK PN: C1005X5R0J475K050BC; Priority: A; Tolerance: 10%; Value: 4.7uF; Part Type: C0402; Manufacturer PN: C1005X5R0J475K050BC; Created by: JJJ
C?#42 = CAP NP_Dup1: cap,100.00nF,+/-10%,10V,X5R,C0201; Part Reference: C1229; Manufacturer: TDK; RK PN: C0603X5R1A104K030BC; Priority: A; Tolerance: 10%; Value: 100nF; Part Type: C0201; Manufacturer PN: C0603X5R1A104K030BC; Created by: JJJ
C?#43 = CAP NP_Dup1: cap,1.00uF,+/-20%,6.3V,X5R,C0201; Part Reference: C1228; Manufacturer PN: C0603X5R0J105M030BC; Manufacturer: TDK; Tolerance: 20%; Priority: A; Value: 1uF; Created by: JJJ; Part Type: C0201; RK PN: C0603X5R0J105M030BC
C?#44 = CAP NP_Dup1: cap,100.00nF,+/-10%,10V,X5R,C0201; Part Reference: C1231; Manufacturer PN: C0603X5R1A104K030BC; Manufacturer: TDK; Tolerance: 10%; Priority: A; Value: 100nF; Created by: JJJ; Part Type: C0201; RK PN: C0603X5R1A104K030BC
R?#16 = RESISTOR_Dup2: НЁУГєсД¤µзЧи,240R,+/-1%,R0201,1/20W.; Part Reference: R1200; Manufacturer: YAGEO; RK PN: RC0201FR-07240RL; Priority: A; Wattage: 1/20W; Value: 240R; Part Type: НЁУГєсД¤µзЧи; Manufacturer PN: RC0201FR-07240RL; Created by: YTL
R?#17 = RESISTOR_Dup2: НЁУГєсД¤µзЧи,240R,+/-1%,R0201,1/20W.; Part Reference: R1202; Manufacturer: YAGEO; RK PN: RC0201FR-07240RL; Priority: A; Wattage: 1/20W; Value: 240R; Part Type: НЁУГєсД¤µзЧи; Manufacturer PN: RC0201FR-07240RL; Created by: YTL
R?#18 = RESISTOR_Dup2: НЁУГєсД¤µзЧи,240R,+/-1%,R0201,1/20W.; Part Reference: R1201; Manufacturer: YAGEO; RK PN: RC0201FR-07240RL; Priority: A; Wattage: 1/20W; Value: 240R; Part Type: НЁУГєсД¤µзЧи; Manufacturer PN: RC0201FR-07240RL; Created by: YTL
R?#19 = RESISTOR_Dup2: НЁУГєсД¤µзЧи,240R,+/-1%,R0201,1/20W.; Part Reference: R1203; Manufacturer PN: RC0201FR-07240RL; Manufacturer: YAGEO; Wattage: 1/20W; Priority: A; Value: 240R; Created by: YTL; Part Type: НЁУГєсД¤µзЧи; RK PN: RC0201FR-07240RL
U?#3 U?#4 = SOC_RK3588: as U?#1 on sheet RK3588_OSC_PLL; Value: RK3588; Created by: YWQ; Manufacturer PN: RK3588; Part Type: SOC; RK PN: RK3588; PCB Footprint: BGA1088_23R00X23R00X2R00

## Sheet RK3588_FLASH_SD_EMMC.SchDoc
size 209 x 297 mm; SheetNumber: 5; SheetTotal: 23
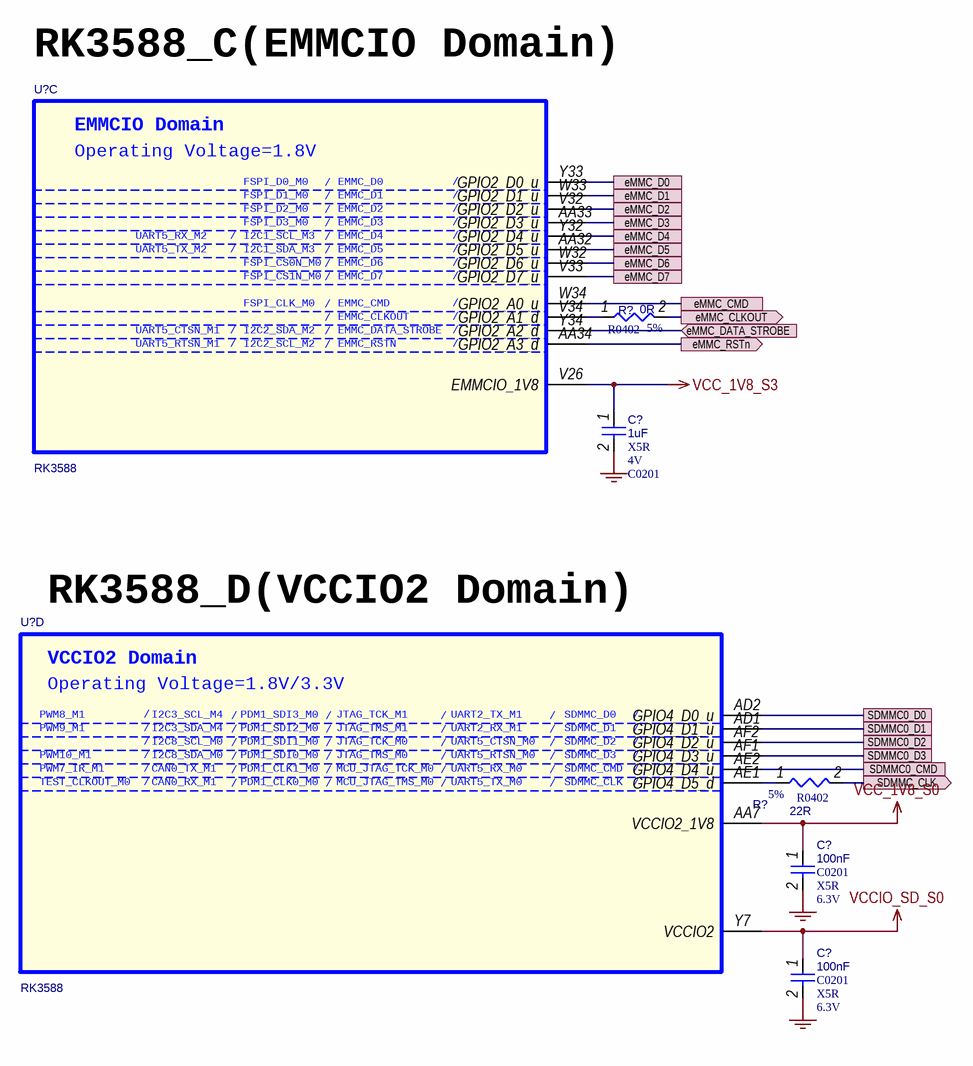
[diagram p6: RK3588_FLASH_SD_EMMC.SchDoc]

### Parts
(Parts that share a designator on the sheet are numbered #1, #2 ... from top to bottom, then left to right.)
C?#45  1uF  Dielectric: X5R  Voltage: 4V  [C0201]
C?#46  100nF  Dielectric: X5R  Voltage: 6.3V  [C0201]
C?#47  100nF  Dielectric: X5R  Voltage: 6.3V  [C0201]
R?#20  0R  Tolerance: 5%  [R0402]
R?#21  22R  Tolerance: 5%  [R0402]
U?#5  RK3588  [BGA1088_23R00X23R00X2R00]  (part C of 26)
U?#6  RK3588  [BGA1088_23R00X23R00X2R00]  (part D of 26)

### Ports
eMMC_CLKOUT (out, see FLASH_EMMC[1C]), eMMC_CMD (see FLASH_EMMC[1C]), eMMC_D0 (see FLASH_EMMC[2B]), eMMC_D1 (see FLASH_EMMC[2B]), eMMC_D2 (see FLASH_EMMC[2B]), eMMC_D3 (see FLASH_EMMC[2B]), eMMC_D4 (see FLASH_EMMC[2B]), eMMC_D5 (see FLASH_EMMC[2B]), eMMC_D6 (see FLASH_EMMC[2B]), eMMC_D7 (see FLASH_EMMC[2B]), eMMC_DATA_STROBE (in, see FLASH_EMMC[1C]), eMMC_RSTn (out, see FLASH_EMMC[1B]), SDMMC0_CMD (see FLASH_SD_CARD[2B]), SDMMC0_D0 (see FLASH_SD_CARD[2B]), SDMMC0_D1 (see FLASH_SD_CARD[2C]), SDMMC0_D2 (see FLASH_SD_CARD[2B]), SDMMC0_D3 (see FLASH_SD_CARD[2B]), SDMMC_CLK (out, see FLASH_SD_CARD[2B])

### Nets
GND: C?#45.2 C?#46.2 C?#47.2
VCC_1V8_S0: C?#46.1 U?#6.AA7(VCCIO2_1V8)
VCC_1V8_S3: C?#45.1 U?#5.V26(EMMCIO_1V8)
VCCIO_SD_S0: C?#47.1 U?#6.Y7(VCCIO2)
eMMC_RSTn: U?#5.AA34(GPIO2_A3_d) ; port eMMC_RSTn
SDMMC0_CMD: U?#6.AE2(GPIO4_D4_u) ; port SDMMC0_CMD
SDMMC0_D0: U?#6.AD2(GPIO4_D0_u) ; port SDMMC0_D0
SDMMC0_D1: U?#6.AD1(GPIO4_D1_u) ; port SDMMC0_D1
SDMMC0_D2: U?#6.AF2(GPIO4_D2_u) ; port SDMMC0_D2
SDMMC0_D3: U?#6.AF1(GPIO4_D3_u) ; port SDMMC0_D3
NetC?#293_1: R?#20.2 ; port eMMC_CLKOUT
NetD?#6_1: R?#21.2 ; port SDMMC_CLK
NetR?#20_1: R?#20.1 U?#5.V34(GPIO2_A1_d)
NetR?#21_1: R?#21.1 U?#6.AE1(GPIO4_D5_d)
NetR?#108_1: U?#5.Y34(GPIO2_A2_d) ; port eMMC_DATA_STROBE
NetU?#5_AA32: U?#5.AA32(GPIO2_D5_u) ; port eMMC_D5
NetU?#5_AA33: U?#5.AA33(GPIO2_D3_u) ; port eMMC_D3
NetU?#5_V32: U?#5.V32(GPIO2_D2_u) ; port eMMC_D2
NetU?#5_V33: U?#5.V33(GPIO2_D7_u) ; port eMMC_D7
NetU?#5_W32: U?#5.W32(GPIO2_D6_u) ; port eMMC_D6
NetU?#5_W33: U?#5.W33(GPIO2_D1_u) ; port eMMC_D1
NetU?#5_W34: U?#5.W34(GPIO2_A0_u) ; port eMMC_CMD
NetU?#5_Y32: U?#5.Y32(GPIO2_D4_u) ; port eMMC_D4
NetU?#5_Y33: U?#5.Y33(GPIO2_D0_u) ; port eMMC_D0

### Notes on the sheet
- RK3588_C(EMMCIO Domain)
- RK3588_D(VCCIO2 Domain)
- 297x210
- Формат А4
- (in symbol SOC_RK3588, part C) EMMCIO Domain; Operating Voltage=1.8V; FSPI_D0_M0; /; EMMC_D0; FSPI_D1_M0; EMMC_D1; FSPI_D2_M0; EMMC_D2; FSPI_D3_M0; EMMC_D3; UART5_RX_M2; I2C1_SCL_M3; EMMC_D4; UART5_TX_M2; I2C1_SDA_M3; EMMC_D5; FSPI_CS0N_M0; EMMC_D6; FSPI_CS1N_M0; EMMC_D7; FSPI_CLK_M0; EMMC_CMD; EMMC_CLKOUT; UART5_CTSN_M1; I2C2_SDA_M2; EMMC_DATA_STROBE; UART5_RTSN_M1; I2C2_SCL_M2; EMMC_RSTN
- (in symbol SOC_RK3588, part D) VCCIO2 Domain; Operating Voltage=1.8V/3.3V; PWM8_M1; /; I2C3_SCL_M4; PDM1_SDI3_M0; JTAG_TCK_M1; UART2_TX_M1; SDMMC_D0; PWM9_M1; I2C3_SDA_M4; PDM1_SDI2_M0; JTAG_TMS_M1; UART2_RX_M1; SDMMC_D1; I2C8_SCL_M0; PDM1_SDI1_M0; JTAG_TCK_M0; UART5_CTSN_M0; SDMMC_D2; PWM10_M1; I2C8_SDA_M0; PDM1_SDI0_M0; JTAG_TMS_M0; UART5_RTSN_M0; SDMMC_D3; PWM7_IR_M1; CAN0_TX_M1; PDM1_CLK1_M0; MCU_JTAG_TCK_M0; UART5_RX_M0; SDMMC_CMD; TEST_CLKOUT_M0; CAN0_RX_M1; PDM1_CLK0_M0; MCU_JTAG_TMS_M0; UART5_TX_M0; SDMMC_CLK

### Library data of the parts
C?#45 = CAP NP_Dup1: cap,1.00uF,+/-20%,4V,X5R,C0201; Part Reference: C1300; Manufacturer: TDK; RK PN: C0603X5R0G105M030BC; Priority: A; Tolerance: 20%; PCB Footprint: C0201; Value: 1uF; Part Type: C0201; Manufacturer PN: C0603X5R0G105M030BC; Created by: JJJ
C?#46 = CAP NP_Dup1: cap,100.00nF,+/-10%,6.3V,X5R,C0201; Part Reference: C1301; Manufacturer: TDK; RK PN: C0603X5R0J104K030BC; Priority: A; Tolerance: 10%; PCB Footprint: C0201; Value: 100nF; Part Type: C0201; Manufacturer PN: C0603X5R0J104K030BC; Created by: JJJ
C?#47 = CAP NP_Dup1: cap,100.00nF,+/-10%,6.3V,X5R,C0201; Part Reference: C1302; Manufacturer PN: C0603X5R0J104K030BC; Manufacturer: TDK; Tolerance: 10%; Priority: A; PCB Footprint: C0201; Value: 100nF; Created by: JJJ; Part Type: C0201; RK PN: C0603X5R0J104K030BC
R?#20 = RESISTOR_Dup2: НЁУГєсД¤µзЧи,0R,+/-5%,R0402,1/16W.; Part Reference: R1317; Manufacturer: YAGEO; RK PN: RC0402JR-070RL; Priority: A; Wattage: 1/16W; PCB Footprint: R0402; Value: 0R; Part Type: НЁУГєсД¤µзЧи; Manufacturer PN: RC0402JR-070RL; Created by: YTL
R?#21 = RESISTOR_Dup2: НЁУГєсД¤µзЧи,22R,+/-5%,R0402,1/16W.; Part Reference: R1320; Manufacturer PN: RC0402JR-0722RL; Manufacturer: YAGEO; Wattage: 1/16W; Priority: A; PCB Footprint: R0402; Value: 22R; Created by: YTL; Part Type: НЁУГєсД¤µзЧи; RK PN: RC0402JR-0722RL
U?#5 U?#6 = SOC_RK3588: as U?#1 on sheet RK3588_OSC_PLL; Value: RK3588; PCB Footprint: BGA1088_23R00X23R00X2R00; Created by: YWQ; Manufacturer PN: RK3588; Part Type: SOC; RK PN: RK3588